# Altium project BMS_AFE.PrjPcb (part 1 of 2)
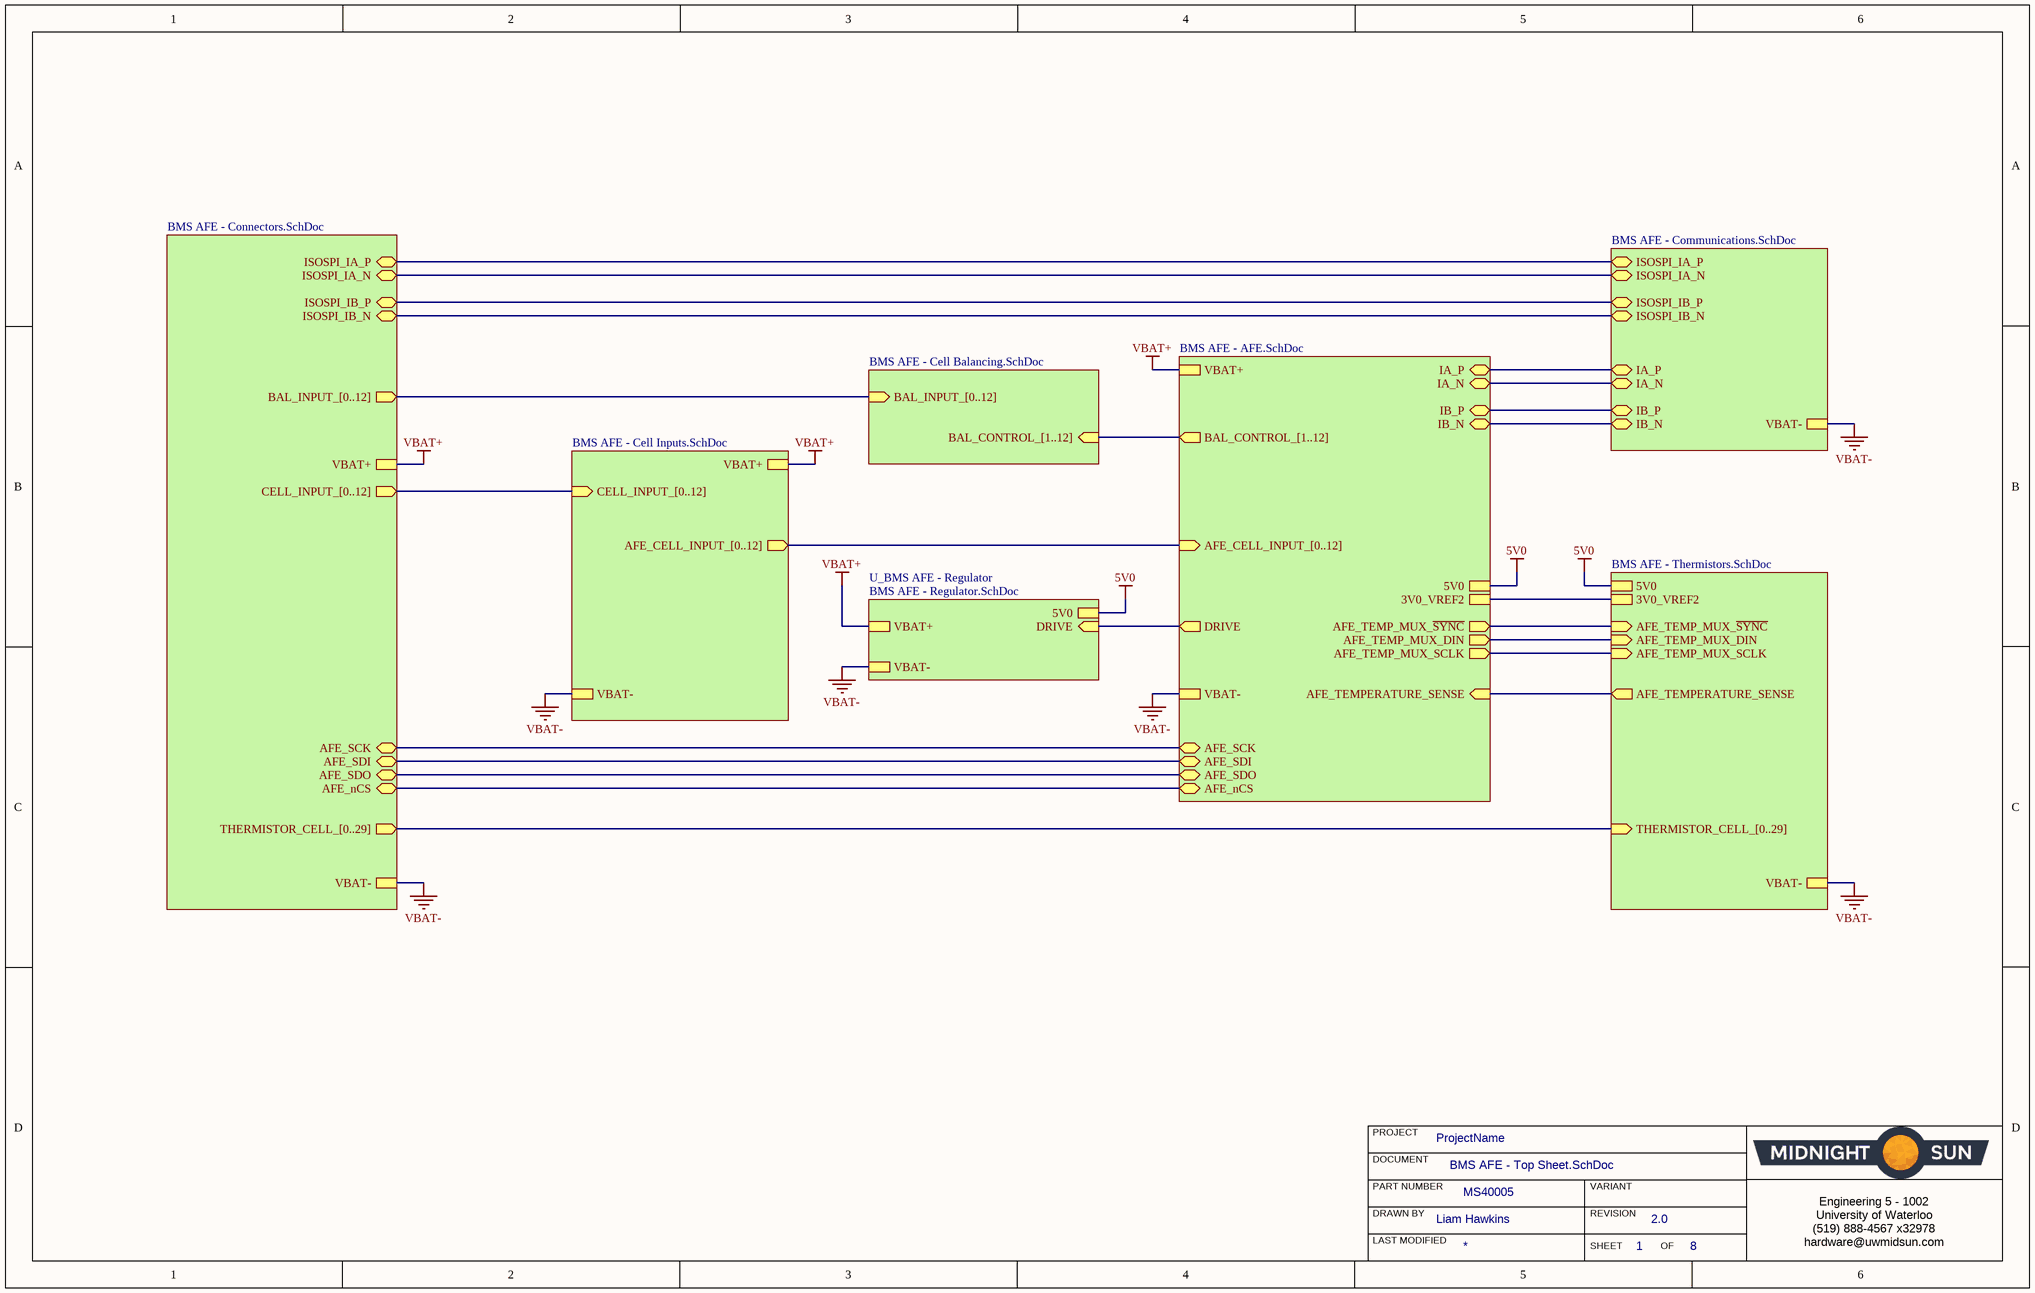
[diagram p0: BMS AFE - Top Sheet.SchDoc]
MSPartNumber: MS40005; ProjectAuthor: Liam Hawkins; ProjectRevision: 2.0
8 sheets, 138 parts. Net scope: strictly hierarchical (ports join the sheet entries above them; power ports are local).
Board file: AFE.PcbDoc
Sheets:
  BMS AFE - Top Sheet.SchDoc
    BMS AFE - AFE = BMS AFE - AFE.SchDoc
    BMS AFE - Cell Balancing = BMS AFE - Cell Balancing.SchDoc
    BMS AFE - Cell Inputs = BMS AFE - Cell Inputs.SchDoc
    BMS AFE - Communications = BMS AFE - Communications.SchDoc
    BMS AFE - Thermistors = BMS AFE - Thermistors.SchDoc
    BMS AFE - Connectors = BMS AFE - Connectors.SchDoc
    U_BMS AFE - Regulator = BMS AFE - Regulator.SchDoc

## Sheet BMS AFE - Top Sheet.SchDoc: Title
size B; Organization: Midnight Sun Solar Rayce Car Team; Address1: University of Waterloo; Address2: 200 University Ave W; Address3: Waterloo, ON, Canada; Address4: N2L 3E9; DocumentNumber: 1; SheetNumber: 1; SheetTotal: 8; Website: www.uwmidsun.com; ProjectName: ProjectName

### Sub-sheets
BMS AFE - AFE = BMS AFE - AFE.SchDoc: BAL_CONTROL_[1..12] (out), AFE_TEMP_MUX_~{SYNC} (out), AFE_nCS (bidir), AFE_SCK (bidir), AFE_TEMP_MUX_SCLK (out), 5V0, VBAT-, 3V0_VREF2, AFE_CELL_INPUT_[0..12] (in), AFE_TEMPERATURE_SENSE (in), AFE_TEMP_MUX_DIN (out), VBAT+, AFE_SDI (bidir), AFE_SDO (bidir), IA_N (bidir), IA_P (bidir), IB_N (bidir), IB_P (bidir), DRIVE (out)
BMS AFE - Cell Balancing = BMS AFE - Cell Balancing.SchDoc: BAL_CONTROL_[1..12] (in), BAL_INPUT_[0..12] (in)
BMS AFE - Cell Inputs = BMS AFE - Cell Inputs.SchDoc: VBAT+, CELL_INPUT_[0..12] (in), AFE_CELL_INPUT_[0..12] (out), VBAT-
BMS AFE - Communications = BMS AFE - Communications.SchDoc: IB_P (bidir), IB_N (bidir), ISOSPI_IA_P (bidir), ISOSPI_IA_N (bidir), IA_P (bidir), ISOSPI_IB_P (bidir), IA_N (bidir), ISOSPI_IB_N (bidir), VBAT-
BMS AFE - Connectors = BMS AFE - Connectors.SchDoc: ISOSPI_IB_N (bidir), ISOSPI_IB_P (bidir), ISOSPI_IA_N (bidir), ISOSPI_IA_P (bidir), VBAT+, AFE_nCS (bidir), AFE_SCK (bidir), CELL_INPUT_[0..12] (out), THERMISTOR_CELL_[0..29] (out), AFE_SDI (bidir), AFE_SDO (bidir), VBAT-, BAL_INPUT_[0..12] (out)
BMS AFE - Thermistors = BMS AFE - Thermistors.SchDoc: AFE_TEMPERATURE_SENSE (out), 5V0, 3V0_VREF2, AFE_TEMP_MUX_SCLK (in), AFE_TEMP_MUX_DIN (in), AFE_TEMP_MUX_~{SYNC} (in), THERMISTOR_CELL_[0..29] (in), VBAT-
U_BMS AFE - Regulator = BMS AFE - Regulator.SchDoc: DRIVE (in), VBAT+, 5V0, VBAT-

### Nets
3V0_VREF2: sheet BMS AFE - AFE/3V0_VREF2, sheet BMS AFE - Thermistors/3V0_VREF2
5V0: sheet BMS AFE - AFE/5V0, sheet BMS AFE - Thermistors/5V0, sheet U_BMS AFE - Regulator/5V0
VBAT+: sheet BMS AFE - AFE/VBAT+, sheet BMS AFE - Cell Inputs/VBAT+, sheet BMS AFE - Connectors/VBAT+, sheet U_BMS AFE - Regulator/VBAT+
VBAT-: sheet BMS AFE - AFE/VBAT-, sheet BMS AFE - Cell Inputs/VBAT-, sheet BMS AFE - Communications/VBAT-, sheet BMS AFE - Thermistors/VBAT-, sheet BMS AFE - Connectors/VBAT-, sheet U_BMS AFE - Regulator/VBAT-
AFE_TEMP_MUX_DIN: sheet BMS AFE - AFE/AFE_TEMP_MUX_DIN, sheet BMS AFE - Thermistors/AFE_TEMP_MUX_DIN
AFE_TEMP_MUX_~{SYNC}: sheet BMS AFE - AFE/AFE_TEMP_MUX_~{SYNC}, sheet BMS AFE - Thermistors/AFE_TEMP_MUX_~{SYNC}
AFE_TEMP_MUX_SCLK: sheet BMS AFE - AFE/AFE_TEMP_MUX_SCLK, sheet BMS AFE - Thermistors/AFE_TEMP_MUX_SCLK
IA_N: sheet BMS AFE - AFE/IA_N, sheet BMS AFE - Communications/IA_N
IA_P: sheet BMS AFE - AFE/IA_P, sheet BMS AFE - Communications/IA_P
IB_N: sheet BMS AFE - AFE/IB_N, sheet BMS AFE - Communications/IB_N
IB_P: sheet BMS AFE - AFE/IB_P, sheet BMS AFE - Communications/IB_P
ISOSPI_IA_N: sheet BMS AFE - Communications/ISOSPI_IA_N, sheet BMS AFE - Connectors/ISOSPI_IA_N
ISOSPI_IA_P: sheet BMS AFE - Communications/ISOSPI_IA_P, sheet BMS AFE - Connectors/ISOSPI_IA_P
ISOSPI_IB_N: sheet BMS AFE - Communications/ISOSPI_IB_N, sheet BMS AFE - Connectors/ISOSPI_IB_N
ISOSPI_IB_P: sheet BMS AFE - Communications/ISOSPI_IB_P, sheet BMS AFE - Connectors/ISOSPI_IB_P
NetC34_1: sheet BMS AFE - AFE/AFE_TEMPERATURE_SENSE, sheet BMS AFE - Thermistors/AFE_TEMPERATURE_SENSE
NetP7_1: sheet BMS AFE - AFE/AFE_nCS, sheet BMS AFE - Connectors/AFE_nCS
NetP7_2: sheet BMS AFE - AFE/AFE_SCK, sheet BMS AFE - Connectors/AFE_SCK
NetP7_3: sheet BMS AFE - AFE/AFE_SDI, sheet BMS AFE - Connectors/AFE_SDI
NetP7_4: sheet BMS AFE - AFE/AFE_SDO, sheet BMS AFE - Connectors/AFE_SDO
NetR52_1: sheet BMS AFE - AFE/DRIVE, sheet U_BMS AFE - Regulator/DRIVE

### Buses and harness runs
bus sheet BMS AFE - AFE/AFE_CELL_INPUT_[0..12] = sheet BMS AFE - Cell Inputs/AFE_CELL_INPUT_[0..12]
bus sheet BMS AFE - AFE/BAL_CONTROL_[1..12] = sheet BMS AFE - Cell Balancing/BAL_CONTROL_[1..12]
bus sheet BMS AFE - Cell Balancing/BAL_INPUT_[0..12] = sheet BMS AFE - Connectors/BAL_INPUT_[0..12]
bus sheet BMS AFE - Cell Inputs/CELL_INPUT_[0..12] = sheet BMS AFE - Connectors/CELL_INPUT_[0..12]
bus sheet BMS AFE - Connectors/THERMISTOR_CELL_[0..29] = sheet BMS AFE - Thermistors/THERMISTOR_CELL_[0..29]

### Notes on the sheet
- PROJECT
- DOCUMENT
- DRAWN BY
- LAST MODIFIED
- PART NUMBER
- REVISION
- SHEET
- VARIANT
- OF
- Engineering 5 - 1002
  University of Waterloo
  (519) 888-4567 x32978
  hardware@uwmidsun.com

## Sheet BMS AFE - AFE.SchDoc: Title
size B; Organization: Midnight Sun Solar Rayce Car Team; Address1: University of Waterloo; Address2: 200 University Ave W; Address3: Waterloo, ON, Canada; Address4: N2L 3E9; DocumentNumber: 5; SheetNumber: 5; SheetTotal: 8; Website: www.uwmidsun.com; ProjectName: ProjectName
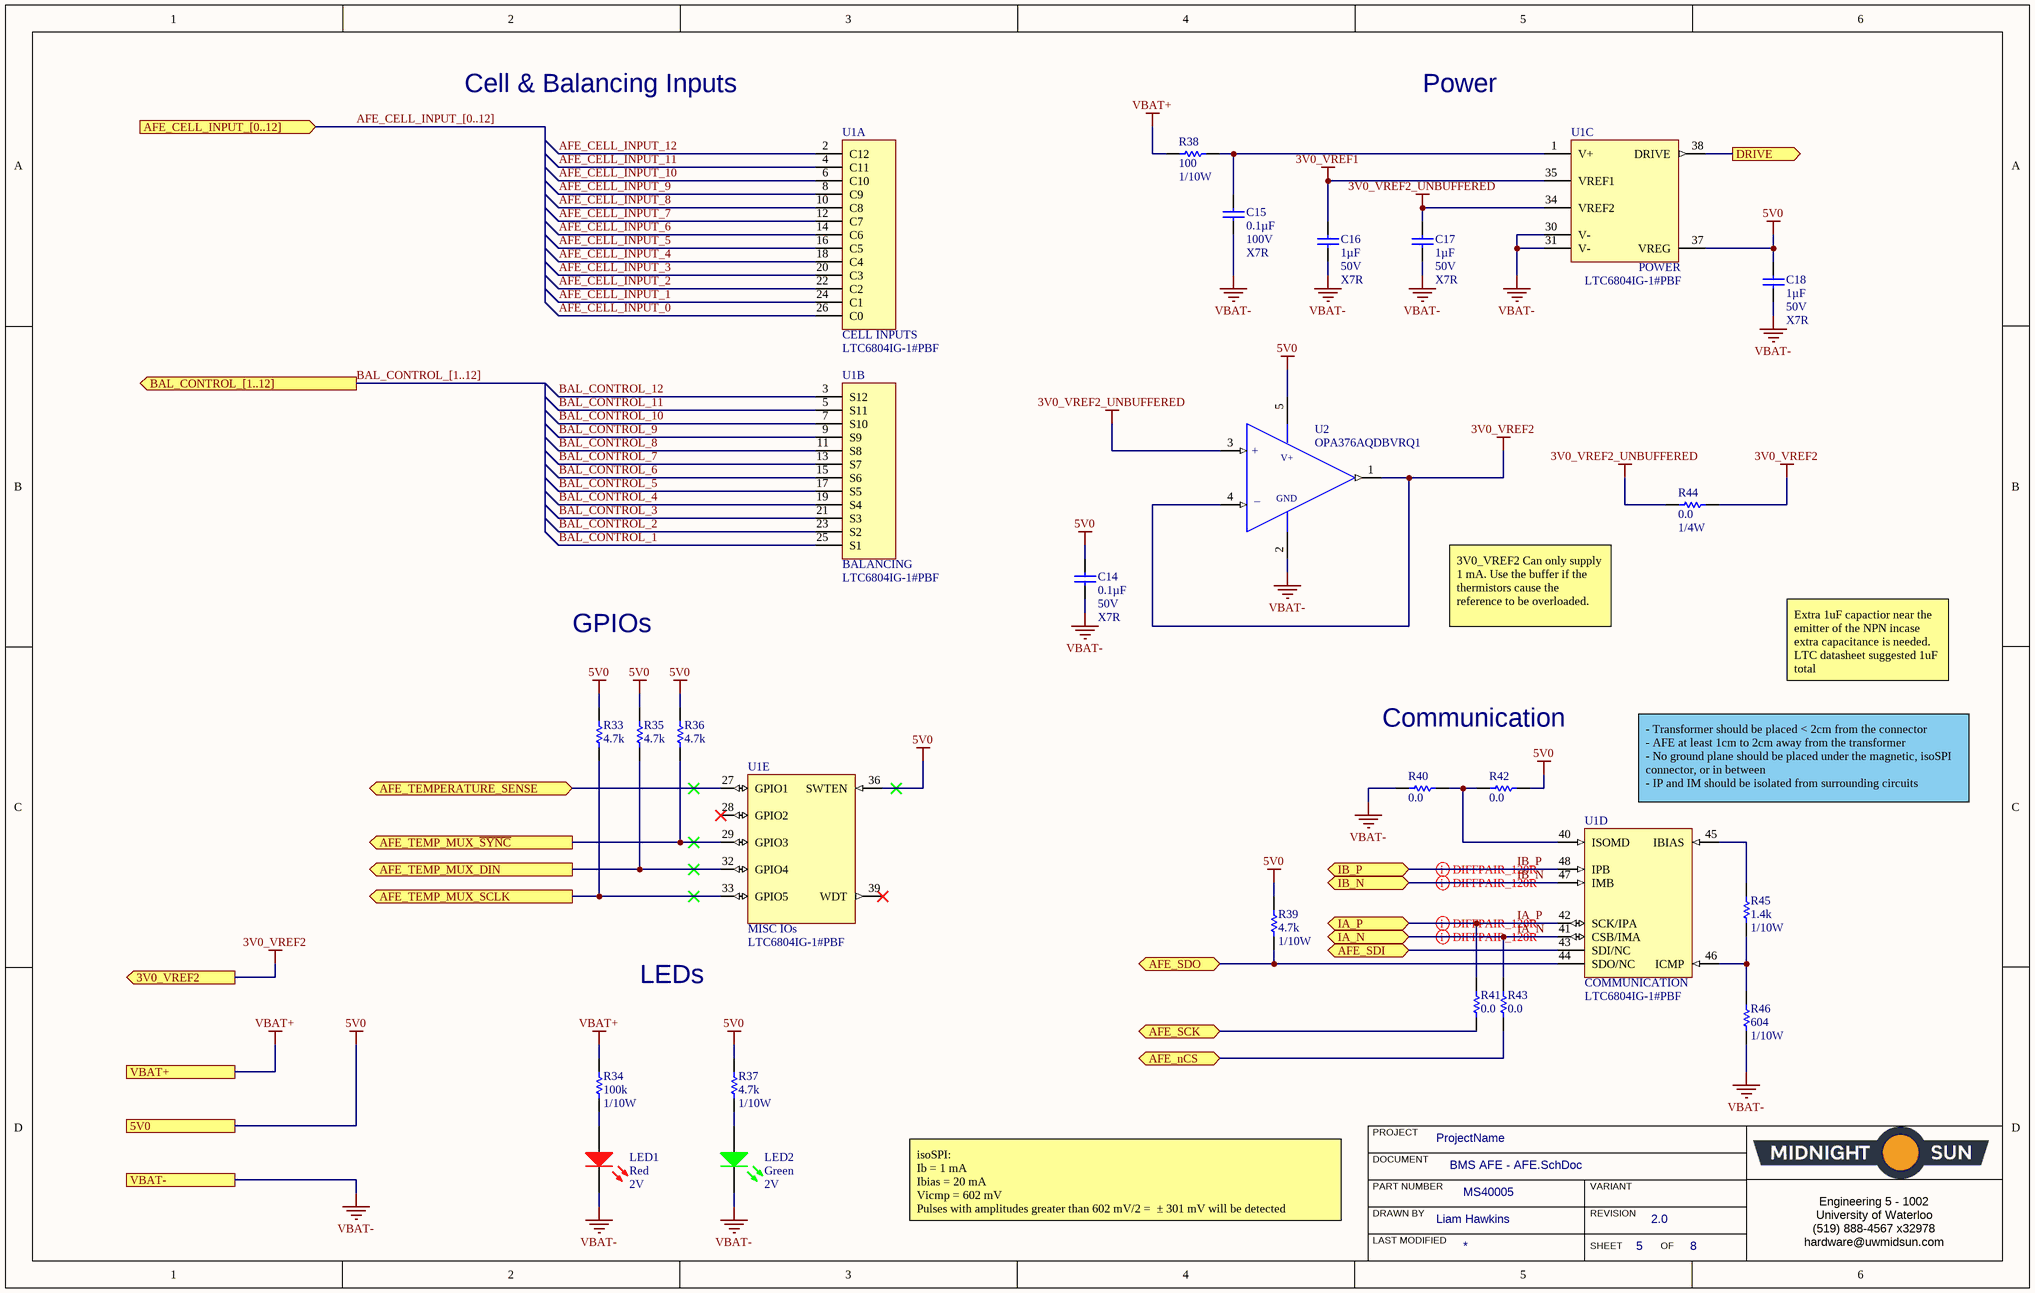
[diagram p1: BMS AFE - AFE.SchDoc]

### Parts
(Parts that share a designator on the sheet are numbered #1, #2 ... from top to bottom, then left to right.)
C14  Capacitance: 0.1µF  Voltage: 50V  Temperature Coefficient: X7R  [CAP, 0603]  (hidden comment: CAP CER 0.1UF 50V 10% X7R 0603)
C15  Capacitance: 0.1µF  Voltage: 100V  Temperature Coefficient: X7R  [CAP, 0805]  (hidden comment: CAP CER 0.1UF 100V 10% X7R 0805)
C16  Capacitance: 1µF  Voltage: 50V  Temperature Coefficient: X7R  [CAP, 0603]  (hidden comment: CAP CER 1UF 50V 10% X7R 0603)
C17  Capacitance: 1µF  Voltage: 50V  Temperature Coefficient: X7R  [CAP, 0603]  (hidden comment: CAP CER 1UF 50V 10% X7R 0603)
C18  Capacitance: 1µF  Voltage: 50V  Temperature Coefficient: X7R  [CAP, 0603]  (hidden comment: CAP CER 1UF 50V 10% X7R 0603)
LED1  Color: Red  Voltage - Forward (Vf) (Typ): 2V  [LED_0603]  (hidden comment: LED RED CLEAR 2V 0603)
LED2  Color: Green  Voltage - Forward (Vf) (Typ): 2V  [LED_0603]  (hidden comment: LED GREEN CLEAR 2V 0603)
R33#1  Resistance (Ohms): 4.7k  [RES, 0603]  (hidden comment: RES 4.7K OHM 1% 1/10W 0603)
R34#1  Resistance: 100k  Power: 1/10W  [RES, 0603]  (hidden comment: RES 100K OHM 5% 1/8W 0603)
R35#1  Resistance (Ohms): 4.7k  [RES, 0603]  (hidden comment: RES 4.7K OHM 1% 1/10W 0603)
R36#1  Resistance (Ohms): 4.7k  [RES, 0603]  (hidden comment: RES 4.7K OHM 1% 1/10W 0603)
R37#1  Resistance (Ohms): 4.7k  Power (Watts): 1/10W  [RES, 0603]  (hidden comment: RES 4.7K OHM 1% 1/10W 0603)
R38#1  Resistance: 100  Power: 1/10W  [RES, 0603]  (hidden comment: RES 100 OHM 1% 1/10W 0603)
R39#1  Resistance (Ohms): 4.7k  Power (Watts): 1/10W  [RES, 0603]  (hidden comment: RES 4.7K OHM 1% 1/10W 0603)
R40#1  Resistance: 0.0  [RES, 0603]  (hidden comment: RES 0.0 OHM 1/4W 0603)
R41  Resistance: 0.0  [RES, 0603]  (hidden comment: RES 0.0 OHM 1/4W 0603)
R42  Resistance: 0.0  [RES, 0603]  (hidden comment: RES 0.0 OHM 1/4W 0603)
R43  Resistance: 0.0  [RES, 0603]  (hidden comment: RES 0.0 OHM 1/4W 0603)
R44  Resistance: 0.0  Power (Watts): 1/4W  [RES, 0603]  (hidden comment: RES 0.0 OHM 1/4W 0603)
R45  Resistance: 1.4k  Power: 1/10W  [RES, 0603]  (hidden comment: RES 1.4k OHM 1% 1/10W 0603)
R46  Resistance: 604  Power: 1/10W  [RES, 0603]  (hidden comment: RES 604 OHM 1% 1/10W 0603)
U1  Manufacturer Part Number 1: LTC6804IG-1#PBF  [SSOP50P780X200-48N]  (hidden comment: IC MONITOR BATT STACK 48SSOP)  (parts A,B,C,D,E of 5)
U2  Manufacturer Part Number: OPA376AQDBVRQ1  [IC OP AMP GP RR 10MHZ SOT-23-5]  (hidden comment: IC OP AMP GEN PURPOSE RR 5.5MHZ SOT-23-5)

### Ports
3V0_VREF2 (out), 5V0, AFE_CELL_INPUT_[0..12] (in), AFE_nCS (bidir), AFE_SCK (bidir), AFE_SDI (bidir), AFE_SDO (bidir), AFE_TEMP_MUX_DIN (out), AFE_TEMP_MUX_SCLK (out), AFE_TEMP_MUX_~{SYNC} (out), AFE_TEMPERATURE_SENSE (bidir), BAL_CONTROL_[1..12] (out), DRIVE (out), IA_N (bidir), IA_P (bidir), IB_N (bidir), IB_P (bidir), VBAT+, VBAT-

### Nets
3V0_VREF1: C16.1 U1.35(VREF1)
3V0_VREF2: R44.2 U2.1(OUTPUT) U2.4(-IN) ; port 3V0_VREF2
3V0_VREF2_UNBUFFERED: C17.1 R44.1 U1.34(VREF2) U2.3(+IN)
5V0: C14.1 C18.1 R33#1.2 R35#1.2 R36#1.2 R37#1.1 R39#1.1 R42.2 U1.36(SWTEN) U1.37(VREG) U2.5(VDD) ; port 5V0
VBAT+: R34#1.1 R38#1.1 ; port VBAT+
VBAT-: C14.2 C15.2 C16.2 C17.2 C18.2 LED1.2(K) LED2.2(K) R40#1.1 R46.2 U1.30(V-) U1.31(V-) U2.2(VSS) ; port VBAT-
AFE_CELL_INPUT_0: U1.26(C0)
AFE_CELL_INPUT_1: U1.24(C1)
AFE_CELL_INPUT_2: U1.22(C2)
AFE_CELL_INPUT_3: U1.20(C3)
AFE_CELL_INPUT_4: U1.18(C4)
AFE_CELL_INPUT_5: U1.16(C5)
AFE_CELL_INPUT_6: U1.14(C6)
AFE_CELL_INPUT_7: U1.12(C7)
AFE_CELL_INPUT_8: U1.10(C8)
AFE_CELL_INPUT_9: U1.8(C9)
AFE_CELL_INPUT_10: U1.6(C10)
AFE_CELL_INPUT_11: U1.4(C11)
AFE_CELL_INPUT_12: U1.2(C12)
AFE_TEMP_MUX_DIN: R35#1.1 U1.32(GPIO4) ; port AFE_TEMP_MUX_DIN
AFE_TEMP_MUX_~{SYNC}: R36#1.1 U1.29(GPIO3) ; port AFE_TEMP_MUX_~{SYNC}
AFE_TEMP_MUX_SCLK: R33#1.1 U1.33(GPIO5) ; port AFE_TEMP_MUX_SCLK
BAL_CONTROL_1: U1.25(S1)
BAL_CONTROL_2: U1.23(S2)
BAL_CONTROL_3: U1.21(S3)
BAL_CONTROL_4: U1.19(S4)
BAL_CONTROL_5: U1.17(S5)
BAL_CONTROL_6: U1.15(S6)
BAL_CONTROL_7: U1.13(S7)
BAL_CONTROL_8: U1.11(S8)
BAL_CONTROL_9: U1.9(S9)
BAL_CONTROL_10: U1.7(S10)
BAL_CONTROL_11: U1.5(S11)
BAL_CONTROL_12: U1.3(S12)
IA_N: R43.1 U1.41(CSB/IMA) ; port IA_N
IA_P: R41.1 U1.42(SCK/IPA) ; port IA_P
IB_N: U1.47(IMB) ; port IB_N
IB_P: U1.48(IPB) ; port IB_P
NetC15_1: C15.1 R38#1.2 U1.1(V+)
NetC34_1: U1.27(GPIO1) ; port AFE_TEMPERATURE_SENSE
NetLED1_1: LED1.1(A) R34#1.2
NetLED2_1: LED2.1(A) R37#1.2
NetP7_1: R43.2 ; port AFE_nCS
NetP7_2: R41.2 ; port AFE_SCK
NetP7_3: U1.43(SDI/NC) ; port AFE_SDI
NetP7_4: R39#1.2 U1.44(SDO/NC) ; port AFE_SDO
NetR40#1_2: R40#1.2 R42.1 U1.40(ISOMD)
NetR45_1: R45.1 U1.45(IBIAS)
NetR45_2: R45.2 R46.1 U1.46(ICMP)
NetR52_1: U1.38(DRIVE) ; port DRIVE

Not connected (* = marked no-connect by the designer): U1 28(GPIO2)* 39(WDT)*

### Buses and harness runs
bus AFE_CELL_INPUT_[0..12] = port AFE_CELL_INPUT_[0..12]
bus BAL_CONTROL_[1..12] = port BAL_CONTROL_[1..12]

### Layout directives
differential pair: IA_N, IA_P, IB_N, IB_P

### Notes on the sheet
- Cell & Balancing Inputs
- Power
- GPIOs
- 3V0_VREF2 Can only supply  1 mA. Use the buffer if the thermistors cause the reference to be overloaded.
- Extra 1uF capactior near the emitter of the NPN incase extra capacitance is needed. LTC datasheet suggested 1uF total
- Communication
- (near U1) - Transformer should be placed < 2cm from the connector
  - AFE at least 1cm to 2cm away from the transformer
  - No ground plane should be placed under the magnetic, isoSPI connector, or in between
  - IP and IM should be isolated from surrounding circuits
- LEDs
- isoSPI:
  Ib = 1 mA
  Ibias = 20 mA
  Vicmp = 602 mV
  Pulses with amplitudes greater than 602 mV/2 =  ± 301 mV will be detected
- PROJECT
- DOCUMENT
- DRAWN BY
- LAST MODIFIED
- PART NUMBER
- REVISION
- SHEET
- VARIANT
- OF
- Engineering 5 - 1002
  University of Waterloo
  (519) 888-4567 x32978
  hardware@uwmidsun.com
- (in symbol IC MONITOR BATT STACK 48SSOP, part A) CELL INPUTS
- (in symbol IC MONITOR BATT STACK 48SSOP, part B) BALANCING
- (in symbol IC MONITOR BATT STACK 48SSOP, part C) POWER
- (in symbol IC MONITOR BATT STACK 48SSOP, part D) COMMUNICATION
- (in symbol IC MONITOR BATT STACK 48SSOP, part E) MISC IOs
- (in symbol IC OP AMP GEN PURPOSE RR 5.5MHZ SOT-23-5) +; V+; GND; _

### Library data of the parts
C14 = CAP CER 0.1UF 50V 10% X7R 0603: 0.10µF ±10% 50V Ceramic Capacitor X7R 0603 (1608 Metric); Manufacturer 1: AVX Corporation; Manufacturer Part Number 1: 06035C104KAT2A; Supplier 1: Digi-Key; Supplier Part Number 1: 478-5052-1-ND; Packaging: Cut Tape (CT); Part Status: Active; Operating Temperature: -55°C ~ 125°C; Ratings: -; Mounting Type: Surface Mount, MLCC; Package / Case: 0603 (1608 Metric); Size / Dimension: 0.063" L x 0.032" W (1.60mm x 0.81mm); Height - Seated (Max): -; Thickness (Max): 0.035" (0.90mm); Lead Spacing: -; Lead Style: -; ComponentLink1URL: http://datasheets.avx.com/X7RDielectric.pdf; ComponentLink1Description: http://datasheets.avx.com/X7RDielectric.pdf; Tolerance: ±10%
C15 = CAP CER 0.1UF 100V 10% X7R 0805: 0.1µF ±10% 100V Ceramic Capacitor X7R 0805 (2012 Metric); Manufacturer 1: Murata Electronics North America; Manufacturer Part Number 1: GCM21BR72A104KA37L; Supplier 1: Digi-Key; Supplier Part Number 1: 490-4789-1-ND; Packaging: Cut Tape (CT); Part Status: Active; Operating Temperature: -55°C ~ 125°C; Ratings: AEC-Q200; Mounting Type: Surface Mount, MLCC; Package / Case: 0805 (2012 Metric); Size / Dimension: 0.079" L x 0.049" W (2.00mm x 1.25mm); Height - Seated (Max): -; Thickness (Max): 0.055" (1.40mm); Lead Spacing: -; Lead Style: -; ComponentLink1URL: http://www.murata.com/~/media/webrenewal/support/library/catalog/products/capacitor/mlcc/c03e.ashx; ComponentLink1Description: http://www.murata.com/~/media/webrenewal/support/library/catalog/products/capacitor/mlcc/c03e.ashx; Tolerance: ±10%
C16-C18 = CAP CER 1UF 50V 10% X7R 0603: 1µF ±10% 50V Ceramic Capacitor X7R 0603 (1608 Metric); Manufacturer 1: Taiyo Yuden; Manufacturer Part Number 1: UMK107AB7105KA-T; Supplier 1: Digi-Key; Supplier Part Number 1: 587-3247-1-ND; Packaging: Cut Tape (CT); Part Status: Active; Operating Temperature: -55°C ~ 125°C; Ratings: -; Mounting Type: Surface Mount, MLCC; Package / Case: 0603 (1608 Metric); Size / Dimension: 0.063" L x 0.031" W (1.60mm x 0.80mm); Height - Seated (Max): -; Thickness (Max): 0.037" (0.95mm); Lead Spacing: -; Lead Style: -; ComponentLink1URL: http://www.yuden.co.jp/productdata/catalog/en/mlcc_all_e.pdf; ComponentLink1Description: http://www.yuden.co.jp/productdata/catalog/en/mlcc_all_e.pdf; Tolerance: ±10%
LED1 = LED RED CLEAR 2V 0603: Red 631nm LED Indication - Discrete 2V 0603 (1608 Metric); Manufacturer: Wurth Electronics Inc.; Manufacturer Part Number: 150060RS75000; Lens Color: Colorless; Millicandela Rating: 250mcd; Lens Style/Size: Rectangle with Flat Top, 1.10mm x 0.70mm; Current - Test: 20mA; Viewing Angle: 140°; Wavelength - Dominant: 625nm; Wavelength - Peak: 630nm; Supplier 1: Digi-Key; RoHS: RoHS Compliant; Category: Optoelectronics; Stock 1: 35521; Pricing 1: 1=0.21, 100=0.1617, 500=0.13964 (CAD); Packaging: Cut Tape (CT); Part Status: Active; Lens Transparency: Clear; Mounting Type: Surface Mount; Features: -; Package / Case: 0603 (1608 Metric); Supplier Device Package: 0603; Size / Dimension: 1.60mm L x 0.80mm W; Height (Max): 0.80mm; ComponentLink1URL: http://katalog.we-online.de/led/datasheet/150060RS75000.pdf; ComponentLink1Description: http://katalog.we-online.de/led/datasheet/150060RS75000.pdf; Supplier Part Number 1: 732-4978-1-ND
LED2 = LED GREEN CLEAR 2V 0603: Green 572nm LED Indication - Discrete 2V 0603 (1608 Metric); Manufacturer: Wurth Electronics Inc.; Manufacturer Part Number: 150060VS75000; Lens Color: Colorless; Millicandela Rating: 40mcd; Lens Style/Size: Rectangle with Flat Top, 1.10mm x 0.70mm; Current - Test: 20mA; Viewing Angle: 140°; Wavelength - Dominant: 570nm; Supplier 1: Digi-Key; RoHS: RoHS Compliant; Category: Optoelectronics; Stock 1: 9408; Pricing 1: 1=0.21, 100=0.1617, 500=0.13964 (CAD); Packaging: Cut Tape (CT); Part Status: Active; Lens Transparency: Clear; Mounting Type: Surface Mount; Wavelength - Peak: 572nm; Features: -; Package / Case: 0603 (1608 Metric); Supplier Device Package: 0603; Size / Dimension: 1.60mm L x 0.80mm W; Height (Max): 0.80mm; ComponentLink1URL: http://katalog.we-online.de/led/datasheet/150060VS75000.pdf; ComponentLink1Description: http://katalog.we-online.de/led/datasheet/150060VS75000.pdf; Supplier Part Number 1: 732-4980-1-ND
R33#1 R35#1 R36#1 R39#1 = RES 4.7K OHM 1% 1/10W 0603: 4.7k Ohm ±1% 0.1W, 1/10W Chip Resistor 0603 (1608 Metric) Moisture Resistant Thick Film; Manufacturer 1: Yageo; Manufacturer Part Number 1: RC0603FR-074K7L; Description 1: RES SMD 4.7K OHM 1% 1/10W 0603; Temperature Coefficient: ±100ppm/°C; Supplier 1: Digi-Key; Supplier Part Number 1: 311-4.70KHRCT-ND; RoHS: RoHS Compliant; Category: Resistors; Stock 1: 3487566; Pricing 1: 1=0.16, 10=0.022, 100=0.0089, 1000=0.00402, 2500=0.00349 (CAD); Packaging: Cut Tape (CT); Part Status: Active; Composition: Thick Film; Features: Moisture Resistant; Operating Temperature: -55°C ~ 155°C; Package / Case: 0603 (1608 Metric); Supplier Device Package: 0603; Size / Dimension: 0.063" L x 0.031" W (1.60mm x 0.80mm); Height - Seated (Max): 0.022" (0.55mm); Failure Rate: -; ComponentLink1URL: http://www.yageo.com/documents/recent/PYu-RC_Group_51_RoHS_L_7.pdf; ComponentLink1Description: http://www.yageo.com/documents/recent/PYu-RC_Group_51_RoHS_L_7.pdf; Tolerance: ±1%
  R33#1 R35#1 R36#1: Power (Watts): 1/10W
R34#1 = RES 100K OHM 5% 1/8W 0603: RES SMD 100K OHM 5% 1/10W 0603; Manufacturer 1: Yageo; Manufacturer Part Number 1: RC0603JR-07100KL; Temperature Coefficient: ±100ppm/°C; Supplier 1: Digi-Key; Supplier Part Number 1: 311-100KGRCT-ND; Packaging: Cut Tape (CT); Part Status: Active; Composition: Thick Film; Operating Temperature: -55°C ~ 155°C; Package / Case: 0603 (1608 Metric); Supplier Device Package: 0603; Size / Dimension: 0.063" L x 0.031" W (1.60mm x 0.80mm); Height - Seated (Max): 0.022" (0.55mm); Failure Rate: -; ComponentLink1URL: http://www.yageo.com/documents/recent/PYu-RC_Group_51_RoHS_L_7.pdf; ComponentLink1Description: http://www.yageo.com/documents/recent/PYu-RC_Group_51_RoHS_L_7.pdf; Tolerance: ±5%
R37#1 = RES 4.7K OHM 1% 1/10W 0603: 4.7k Ohm ±1% 0.1W, 1/10W Chip Resistor 0603 (1608 Metric) Moisture Resistant Thick Film; Manufacturer 1: Yageo; Manufacturer Part Number 1: RC0603FR-074K7L; Temperature Coefficient: ±100ppm/°C; Description 1: RES SMD 4.7K OHM 1% 1/10W 0603; Supplier 1: Digi-Key; Supplier Part Number 1: 311-4.70KHRCT-ND; Packaging: Cut Tape (CT); Part Status: Active; Composition: Thick Film; Operating Temperature: -55°C ~ 155°C; Package / Case: 0603 (1608 Metric); Supplier Device Package: 0603; Size / Dimension: 0.063" L x 0.031" W (1.60mm x 0.80mm); Height - Seated (Max): 0.022" (0.55mm); Failure Rate: -; ComponentLink1URL: http://www.yageo.com/documents/recent/PYu-RC_Group_51_RoHS_L_7.pdf; ComponentLink1Description: http://www.yageo.com/documents/recent/PYu-RC_Group_51_RoHS_L_7.pdf; Tolerance: ±1%; RoHS: RoHS Compliant; Category: Resistors; Stock 1: 3487566; Pricing 1: 1=0.16, 10=0.022, 100=0.0089, 1000=0.00402, 2500=0.00349 (CAD); Features: Moisture Resistant
R38#1 = RES 100 OHM 1% 1/10W 0603: 100 Ohm ±1% 0.1W, 1/10W Chip Resistor 0603 (1608 Metric) Moisture Resistant Thick Film; Manufacturer 1: Yageo; Manufacturer Part Number 1: RC0603FR-07100RL; Temperature Coefficient: ±100ppm/°C; Supplier 1: Digi-Key; Supplier Part Number 1: 311-100HRCT-ND; Packaging: Cut Tape (CT); Part Status: Active; Composition: Thick Film; Operating Temperature: -55°C ~ 155°C; Package / Case: 0603 (1608 Metric); Supplier Device Package: 0603; Size / Dimension: 0.063" L x 0.031" W (1.60mm x 0.80mm); Height - Seated (Max): 0.022" (0.55mm); Failure Rate: -; ComponentLink1URL: http://www.yageo.com/documents/recent/PYu-RC_Group_51_RoHS_L_7.pdf; ComponentLink1Description: http://www.yageo.com/documents/recent/PYu-RC_Group_51_RoHS_L_7.pdf; Tolerance: ±1%
R40#1 R41-R44 = RES 0.0 OHM 1/4W 0603: RES SMD 0.0 OHM JUMPER 1/4W 0603; Manufacturer 1: Vishay Dale; Manufacturer Part Number 1: CRCW06030000Z0EAHP; Supplier 1: Digi-Key; Supplier Part Number 1: 541-0.0SBCT-ND; Packaging: Cut Tape (CT); Part Status: Active; Composition: Thick Film; Operating Temperature: -55°C ~ 155°C; Package / Case: 0603 (1608 Metric); Supplier Device Package: 0603; Size / Dimension: 0.063" L x 0.033" W (1.60mm x 0.85mm); Height - Seated (Max): 0.022" (0.55mm); Failure Rate: -; ComponentLink1URL: http://www.vishay.com/docs/20043/crcwhpe3.pdf; ComponentLink1Description: http://www.vishay.com/docs/20043/crcwhpe3.pdf
  R40#1 R41-R43: Power (Watts): 1/4W
R45 = RES 1.4k OHM 1% 1/10W 0603: RES SMD 1.4K OHM 1% 1/10W 0603; Manufacturer 1: Yageo; Manufacturer Part Number 1: RC0603FR-071K4L; Temperature Coefficient: ±100ppm/°C; Supplier 1: Digi-Key; Supplier Part Number 1: 311-1.40KHRCT-ND; Packaging: Cut Tape (CT); Part Status: Active; Composition: Thick Film; Operating Temperature: -55°C ~ 155°C; Package / Case: 0603 (1608 Metric); Supplier Device Package: 0603; Size / Dimension: 0.063" L x 0.031" W (1.60mm x 0.80mm); Height - Seated (Max): 0.022" (0.55mm); Failure Rate: -; ComponentLink1URL: http://www.yageo.com/documents/recent/PYu-RC_Group_51_RoHS_L_7.pdf; ComponentLink1Description: http://www.yageo.com/documents/recent/PYu-RC_Group_51_RoHS_L_7.pdf; Tolerance: ±1%
R46 = RES 604 OHM 1% 1/10W 0603: RES SMD 604 OHM 1% 1/10W 0603; Manufacturer 1: Yageo; Manufacturer Part Number 1: RC0603FR-07604RL; Temperature Coefficient: ±100ppm/°C; Supplier 1: Digi-Key; Supplier Part Number 1: 311-604HRCT-ND; Packaging: Cut Tape (CT); Part Status: Active; Composition: Thick Film; Operating Temperature: -55°C ~ 155°C; Package / Case: 0603 (1608 Metric); Supplier Device Package: 0603; Size / Dimension: 0.063" L x 0.031" W (1.60mm x 0.80mm); Height - Seated (Max): 0.022" (0.55mm); Failure Rate: -; ComponentLink1URL: http://www.yageo.com/documents/recent/PYu-RC_Group_51_RoHS_L_7.pdf; ComponentLink1Description: http://www.yageo.com/documents/recent/PYu-RC_Group_51_RoHS_L_7.pdf; Tolerance: ±1%
U1 = IC MONITOR BATT STACK 48SSOP: Battery Battery Monitor IC Multi-Chemistry 48-SSOP; Manufacturer 1: Linear Technology; Number of Cells: 1 ~ 12; Fault Protection: Over/Under Voltage; Interface: I²C, SPI; Supplier 1: Digi-Key; Supplier Part Number 1: LTC6804IG-1#PBF-ND; Packaging: Tube; Part Status: Active; Function: Battery Monitor; Battery Chemistry: Multi-Chemistry; Operating Temperature: -40°C ~ 85°C (TA); Package / Case: 48-FSOP (0.209", 5.30mm Width); Supplier Device Package: 48-SSOP; ComponentLink1URL: http://www.linear.com/docs/43171; ComponentLink1Description: http://www.linear.com/docs/43171
U2 = IC OP AMP GEN PURPOSE RR 5.5MHZ SOT-23-5: General Purpose Amplifier 1 Circuit Rail-to-Rail SOT-23-5; Manufacturer: Texas Instruments; Max Supply Voltage: 5.5V; Min Supply Voltage: 2.2V; Output Current: 30mA; Nominal Supply Current: 950uA; Voltage Gain: 134dB; Common Mode Rejection Ratio: 76dB; Number of Channels: 1; Slew Rate: 2V/µs; Max I/O Voltage: 25uV; Input Bias Current: 10pA; Operating Supply Current: 760uA; Output Current per Channel: 50mA; Power Supply Rejection Ratio (PSRR): 106.02dB; Supplier 1: Digi-Key; Stock 1: 26635; Pricing 1: 1 = 2.14000, 10 = 1.92200, 100 = 1.54450, 500 = 1.26896, 1000 = 1.05142 (USD); RoHS: Yes; Case/Package: SOT-23-5; Number of Pins: 5; Min Operating Temperature: -40°C; Max Operating Temperature: 125°C; Unity Gain Bandwidth Product: 5.5MHz; Packaging: Tape and Reel; Package Quantity: 3000; Number of Circuits: 1; Gain Bandwidth Product: 5.5MHz; Input Offset Voltage (Vos): 25uV; Number of Elements: 1; Radiation Hardening: No; Lead Free: Lead Free; ComponentLink1URL: http://www.ti.com/lit/ds/sbos549/sbos549.pdf?src-supplier=Avnet; ComponentLink1Description: http://www.ti.com/lit/ds/sbos549/sbos549.pdf?src-supplier=Avnet; Supplier Part Number 1: 296-36701-1-ND

## Sheet BMS AFE - Cell Balancing.SchDoc: Title
size B; Organization: Midnight Sun Solar Rayce Car Team; Address1: University of Waterloo; Address2: 200 University Ave W; Address3: Waterloo, ON, Canada; Address4: N2L 3E9; DocumentNumber: 4; SheetNumber: 4; SheetTotal: 7; Website: www.uwmidsun.com; ProjectName: ProjectName
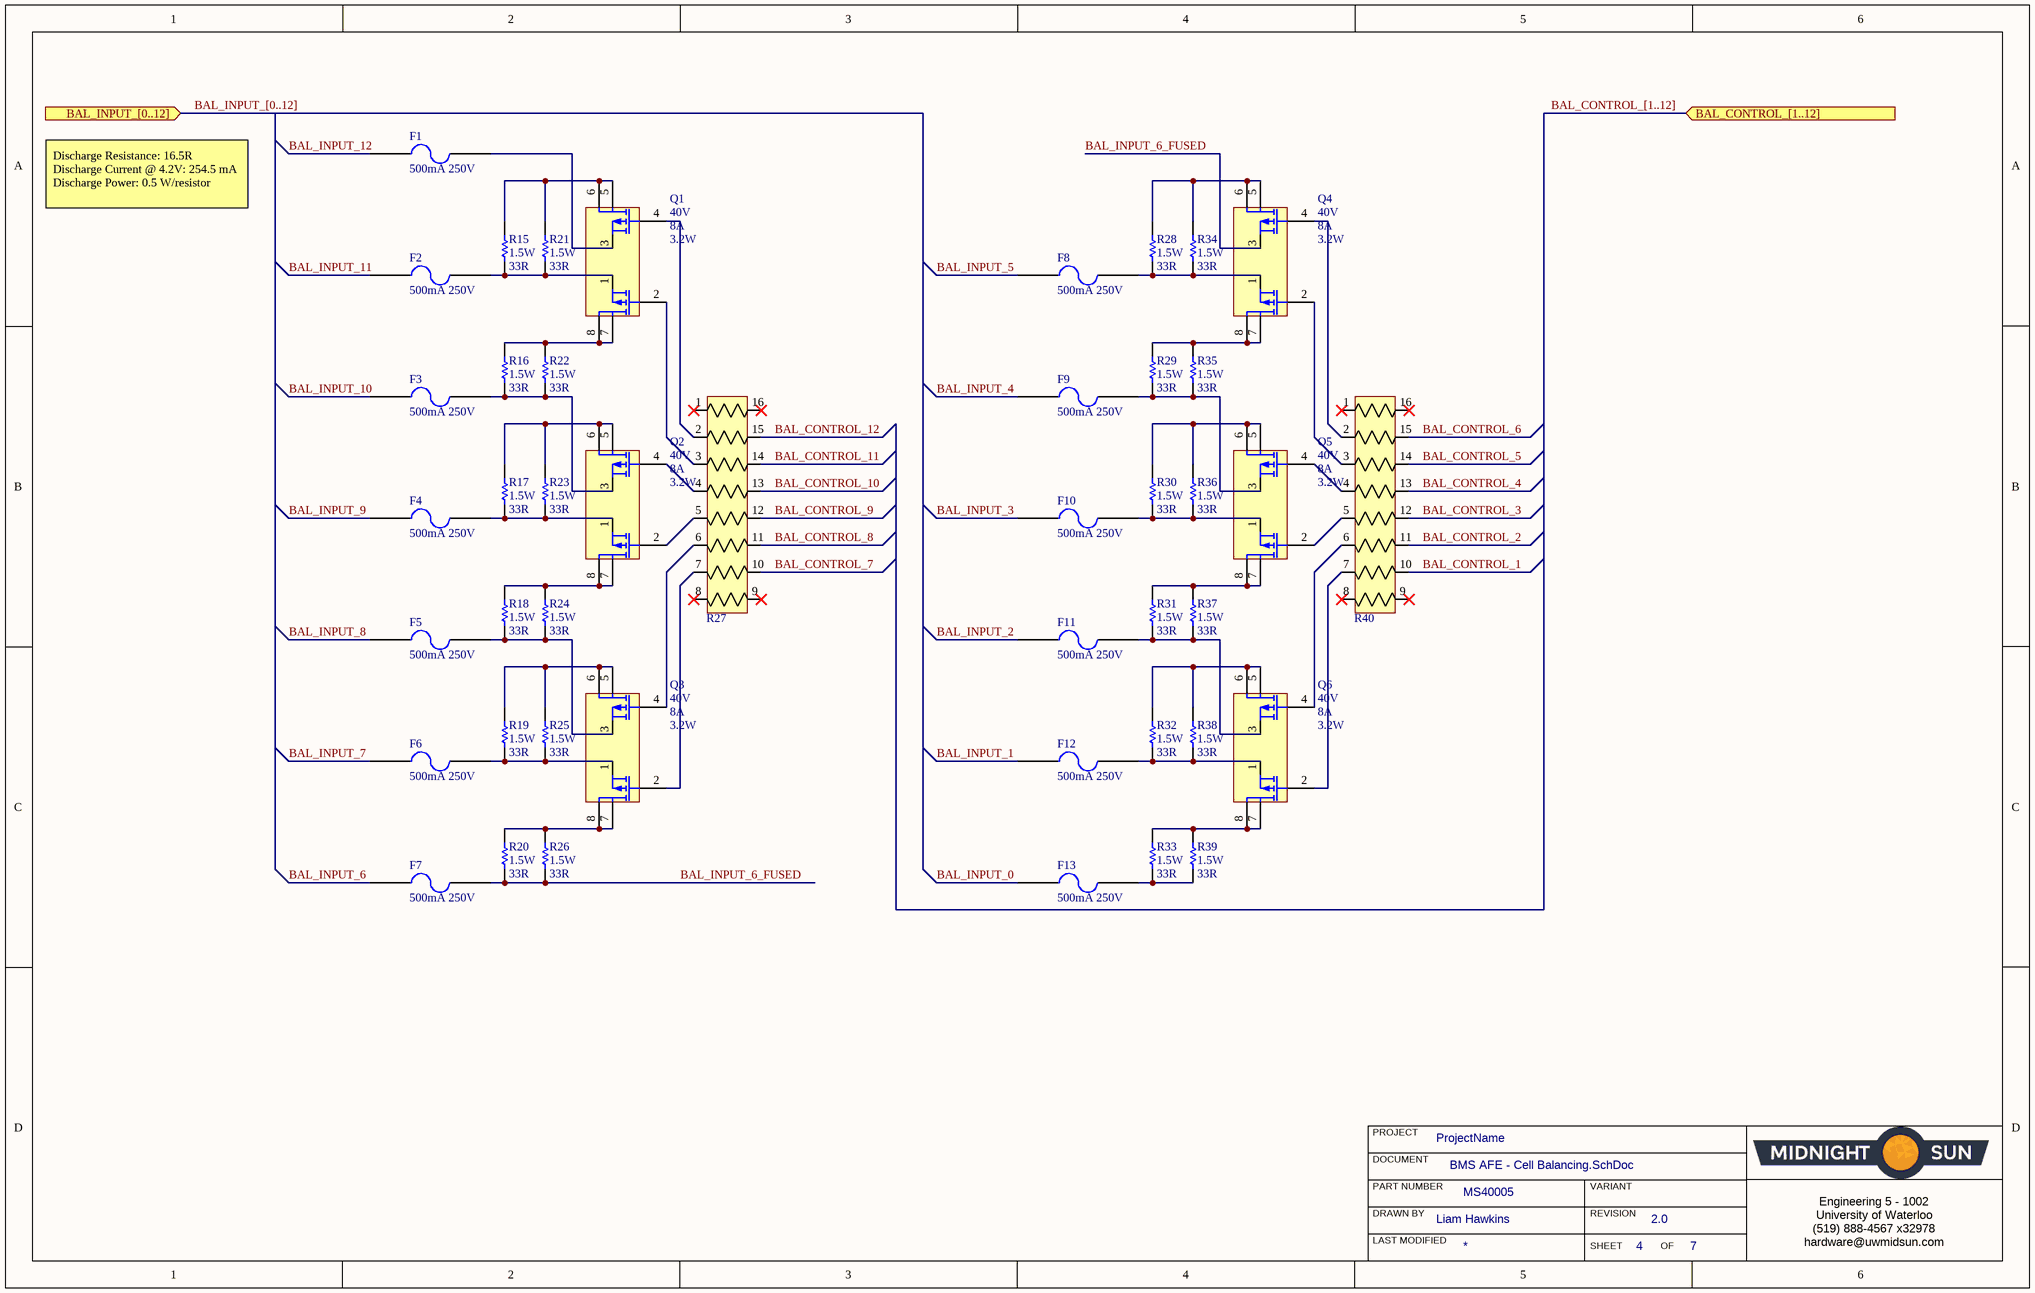
[diagram p2: BMS AFE - Cell Balancing.SchDoc]

### Parts
(Parts that share a designator on the sheet are numbered #1, #2 ... from top to bottom, then left to right.)
F1  500mA 250V  [FUSE JFC2410-0500FS]
F2  500mA 250V  [FUSE JFC2410-0500FS]
F3  500mA 250V  [FUSE JFC2410-0500FS]
F4  500mA 250V  [FUSE JFC2410-0500FS]
F5  500mA 250V  [FUSE JFC2410-0500FS]
F6  500mA 250V  [FUSE JFC2410-0500FS]
F7  500mA 250V  [FUSE JFC2410-0500FS]
F8  500mA 250V  [FUSE JFC2410-0500FS]
F9  500mA 250V  [FUSE JFC2410-0500FS]
F10  500mA 250V  [FUSE JFC2410-0500FS]
F11  500mA 250V  [FUSE JFC2410-0500FS]
F12  500mA 250V  [FUSE JFC2410-0500FS]
F13  500mA 250V  [FUSE JFC2410-0500FS]
Q1  Drain to Source Voltage (Vdss): 40V  Current - Continuous Drain (Id) @ 25°C: 8A  Power - Max: 3.2W  [SOIC8]  (hidden comment: MOSFET DUAL P-CH 40V 8A 3.2W 8-SOIC)
Q2  Drain to Source Voltage (Vdss): 40V  Current - Continuous Drain (Id) @ 25°C: 8A  Power - Max: 3.2W  [SOIC8]  (hidden comment: MOSFET DUAL P-CH 40V 8A 3.2W 8-SOIC)
Q3  Drain to Source Voltage (Vdss): 40V  Current - Continuous Drain (Id) @ 25°C: 8A  Power - Max: 3.2W  [SOIC8]  (hidden comment: MOSFET DUAL P-CH 40V 8A 3.2W 8-SOIC)
Q4  Drain to Source Voltage (Vdss): 40V  Current - Continuous Drain (Id) @ 25°C: 8A  Power - Max: 3.2W  [SOIC8]  (hidden comment: MOSFET DUAL P-CH 40V 8A 3.2W 8-SOIC)
Q5  Drain to Source Voltage (Vdss): 40V  Current - Continuous Drain (Id) @ 25°C: 8A  Power - Max: 3.2W  [SOIC8]  (hidden comment: MOSFET DUAL P-CH 40V 8A 3.2W 8-SOIC)
Q6  Drain to Source Voltage (Vdss): 40V  Current - Continuous Drain (Id) @ 25°C: 8A  Power - Max: 3.2W  [SOIC8]  (hidden comment: MOSFET DUAL P-CH 40V 8A 3.2W 8-SOIC)
R15  value 33R  Power (Watts): 1.5W  [RES STACKPOLE RPC2512 2512]  (hidden comment: RES 33 OHM 5% 1.5W 2512)
R16  value 33R  Power (Watts): 1.5W  [RES STACKPOLE RPC2512 2512]  (hidden comment: RES 33 OHM 5% 1.5W 2512)
R17  value 33R  Power (Watts): 1.5W  [RES STACKPOLE RPC2512 2512]  (hidden comment: RES 33 OHM 5% 1.5W 2512)
R18  value 33R  Power (Watts): 1.5W  [RES STACKPOLE RPC2512 2512]  (hidden comment: RES 33 OHM 5% 1.5W 2512)
R19  value 33R  Power (Watts): 1.5W  [RES STACKPOLE RPC2512 2512]  (hidden comment: RES 33 OHM 5% 1.5W 2512)
R20  value 33R  Power (Watts): 1.5W  [RES STACKPOLE RPC2512 2512]  (hidden comment: RES 33 OHM 5% 1.5W 2512)
R21  value 33R  Power (Watts): 1.5W  [RES STACKPOLE RPC2512 2512]  (hidden comment: RES 33 OHM 5% 1.5W 2512)
R22  value 33R  Power (Watts): 1.5W  [RES STACKPOLE RPC2512 2512]  (hidden comment: RES 33 OHM 5% 1.5W 2512)
R23  value 33R  Power (Watts): 1.5W  [RES STACKPOLE RPC2512 2512]  (hidden comment: RES 33 OHM 5% 1.5W 2512)
R24  value 33R  Power (Watts): 1.5W  [RES STACKPOLE RPC2512 2512]  (hidden comment: RES 33 OHM 5% 1.5W 2512)
R25  value 33R  Power (Watts): 1.5W  [RES STACKPOLE RPC2512 2512]  (hidden comment: RES 33 OHM 5% 1.5W 2512)
R26  value 33R  Power (Watts): 1.5W  [RES STACKPOLE RPC2512 2512]  (hidden comment: RES 33 OHM 5% 1.5W 2512)
R27  RES ARRAY 3.3K OHM 2% 16SOIC  [SOIC16]  (value not drawn)
R28  value 33R  Power (Watts): 1.5W  [RES STACKPOLE RPC2512 2512]  (hidden comment: RES 33 OHM 5% 1.5W 2512)
R29  value 33R  Power (Watts): 1.5W  [RES STACKPOLE RPC2512 2512]  (hidden comment: RES 33 OHM 5% 1.5W 2512)
R30  value 33R  Power (Watts): 1.5W  [RES STACKPOLE RPC2512 2512]  (hidden comment: RES 33 OHM 5% 1.5W 2512)
R31  value 33R  Power (Watts): 1.5W  [RES STACKPOLE RPC2512 2512]  (hidden comment: RES 33 OHM 5% 1.5W 2512)
R32  value 33R  Power (Watts): 1.5W  [RES STACKPOLE RPC2512 2512]  (hidden comment: RES 33 OHM 5% 1.5W 2512)
R33#2  value 33R  Power (Watts): 1.5W  [RES STACKPOLE RPC2512 2512]  (hidden comment: RES 33 OHM 5% 1.5W 2512)
R34#2  value 33R  Power (Watts): 1.5W  [RES STACKPOLE RPC2512 2512]  (hidden comment: RES 33 OHM 5% 1.5W 2512)
R35#2  value 33R  Power (Watts): 1.5W  [RES STACKPOLE RPC2512 2512]  (hidden comment: RES 33 OHM 5% 1.5W 2512)
R36#2  value 33R  Power (Watts): 1.5W  [RES STACKPOLE RPC2512 2512]  (hidden comment: RES 33 OHM 5% 1.5W 2512)
R37#2  value 33R  Power (Watts): 1.5W  [RES STACKPOLE RPC2512 2512]  (hidden comment: RES 33 OHM 5% 1.5W 2512)
R38#2  value 33R  Power (Watts): 1.5W  [RES STACKPOLE RPC2512 2512]  (hidden comment: RES 33 OHM 5% 1.5W 2512)
R39#2  value 33R  Power (Watts): 1.5W  [RES STACKPOLE RPC2512 2512]  (hidden comment: RES 33 OHM 5% 1.5W 2512)
R40#2  RES ARRAY 3.3K OHM 2% 16SOIC  [SOIC16]  (value not drawn)

### Ports
BAL_CONTROL_[1..12] (in), BAL_INPUT_[0..12] (in)

### Nets
BAL_CONTROL_1: R40#2.10
BAL_CONTROL_2: R40#2.11
BAL_CONTROL_3: R40#2.12
BAL_CONTROL_4: R40#2.13
BAL_CONTROL_5: R40#2.14
BAL_CONTROL_6: R40#2.15
BAL_CONTROL_7: R27.10
BAL_CONTROL_8: R27.11
BAL_CONTROL_9: R27.12
BAL_CONTROL_10: R27.13
BAL_CONTROL_11: R27.14
BAL_CONTROL_12: R27.15
BAL_INPUT_0: F13.1
BAL_INPUT_1: F12.1
BAL_INPUT_2: F11.1
BAL_INPUT_3: F10.1
BAL_INPUT_4: F9.1
BAL_INPUT_5: F8.1
BAL_INPUT_6: F7.1
BAL_INPUT_6_FUSED: F7.2 Q4.3(S2) R20.1 R26.1
BAL_INPUT_7: F6.1
BAL_INPUT_8: F5.1
BAL_INPUT_9: F4.1
BAL_INPUT_10: F3.1
BAL_INPUT_11: F2.1
BAL_INPUT_12: F1.1
NetF1_2: F1.2 Q1.3(S2)
NetF2_2: F2.2 Q1.1(S1) R15.1 R21.1
NetF3_2: F3.2 Q2.3(S2) R16.1 R22.1
NetF4_2: F4.2 Q2.1(S1) R17.1 R23.1
NetF5_2: F5.2 Q3.3(S2) R18.1 R24.1
NetF6_2: F6.2 Q3.1(S1) R19.1 R25.1
NetF8_2: F8.2 Q4.1(S1) R28.1 R34#2.1
NetF9_2: F9.2 Q5.3(S2) R29.1 R35#2.1
NetF10_2: F10.2 Q5.1(S1) R30.1 R36#2.1
NetF11_2: F11.2 Q6.3(S2) R31.1 R37#2.1
NetF12_2: F12.2 Q6.1(S1) R32.1 R38#2.1
NetF13_2: F13.2 R33#2.1 R39#2.1
NetQ1_2: Q1.2(G1) R27.3
NetQ1_4: Q1.4(G2) R27.2
NetQ1_5: Q1.5(D2) Q1.6(D2) R15.2 R21.2
NetQ1_7: Q1.7(D1) Q1.8(D1) R16.2 R22.2
NetQ2_2: Q2.2(G1) R27.5
NetQ2_4: Q2.4(G2) R27.4
NetQ2_5: Q2.5(D2) Q2.6(D2) R17.2 R23.2
NetQ2_7: Q2.7(D1) Q2.8(D1) R18.2 R24.2
NetQ3_2: Q3.2(G1) R27.7
NetQ3_4: Q3.4(G2) R27.6
NetQ3_5: Q3.5(D2) Q3.6(D2) R19.2 R25.2
NetQ3_7: Q3.7(D1) Q3.8(D1) R20.2 R26.2
NetQ4_2: Q4.2(G1) R40#2.3
NetQ4_4: Q4.4(G2) R40#2.2
NetQ4_5: Q4.5(D2) Q4.6(D2) R28.2 R34#2.2
NetQ4_7: Q4.7(D1) Q4.8(D1) R29.2 R35#2.2
NetQ5_2: Q5.2(G1) R40#2.5
NetQ5_4: Q5.4(G2) R40#2.4
NetQ5_5: Q5.5(D2) Q5.6(D2) R30.2 R36#2.2
NetQ5_7: Q5.7(D1) Q5.8(D1) R31.2 R37#2.2
NetQ6_2: Q6.2(G1) R40#2.7
NetQ6_4: Q6.4(G2) R40#2.6
NetQ6_5: Q6.5(D2) Q6.6(D2) R32.2 R38#2.2
NetQ6_7: Q6.7(D1) Q6.8(D1) R33#2.2 R39#2.2

Not connected (* = marked no-connect by the designer): R27 1* 8* 9* 16*; R40#2 1* 8* 9* 16*

### Buses and harness runs
bus BAL_CONTROL_[1..12] = port BAL_CONTROL_[1..12]
bus BAL_INPUT_[0..12] = port BAL_INPUT_[0..12]

### Notes on the sheet
- Discharge Resistance: 16.5R
  Discharge Current @ 4.2V: 254.5 mA
  Discharge Power: 0.5 W/resistor
- PROJECT
- DOCUMENT
- DRAWN BY
- LAST MODIFIED
- PART NUMBER
- REVISION
- SHEET
- VARIANT
- OF
- Engineering 5 - 1002
  University of Waterloo
  (519) 888-4567 x32978
  hardware@uwmidsun.com

### Library data of the parts
F1-F13 = FUSE 500MA LCSC: 2410 Surface Mount Fuses RoHS; Manufacturer 1: Shenzen JDT Fuse; Manufacturer Part Number 1: JFC2410-0500FS; ComponentLink1Description: Shenzhen JDT Fuse; ComponentLink1URL: https://datasheet.lcsc.com/szlcsc/1809211424_Shenzhen-JDT-Fuse-JFC2410-0500FS_C136360.pdf; Supplier 1: LCSC; Supplier Part Number 1: C136360; Pricing 1: 1=0.0591USD
Q1-Q6 = MOSFET DUAL P-CH 40V 8A 3.2W 8-SOIC: Mosfet Array 2 P-Channel (Dual) 40V 8A 3.2W Surface Mount 8-SO; Manufacturer 1: Vishay Siliconix; Manufacturer Part Number 1: SI4909DY-T1-GE3; Description 1: MOSFET 2P-CH 40V 8A 8SO; FET Feature: Logic Level Gate; Rds On (Max) @ Id, Vgs: 27 mOhm @ 8A, 10V; Vgs(th) (Max) @ Id: 2.5V @ 250µA; Gate Charge (Qg) (Max) @ Vgs: 63nC @ 10V; Input Capacitance (Ciss) (Max) @ Vds: 2000pF @ 20V; Supplier 1: Digi-Key; Supplier Part Number 1: SI4909DY-T1-GE3CT-ND; RoHS: RoHS Compliant; Category: Discrete Semiconductor Products; Stock 1: 11582; Pricing 1: 1=1.57, 10=1.407, 25=1.3352, 100=1.0969, 250=1.02536, 500=0.90614, 1000=0.71538 (CAD); Packaging: Cut Tape (CT); Part Status: Active; FET Type: 2 P-Channel (Dual); Operating Temperature: -55°C ~ 150°C (TJ); Mounting Type: Surface Mount; Package / Case: 8-SOIC (0.154", 3.90mm Width); Supplier Device Package: 8-SO; ComponentLink1URL: http://www.vishay.com/docs/67077/si4909dy.pdf; ComponentLink1Description: http://www.vishay.com/docs/67077/si4909dy.pdf
R15-R26 R28-R32 R33#2 R34#2 R35#2 R36#2 R37#2 R38#2 R39#2 = RES 33 OHM 5% 1.5W 2512: 33 Ohms ±5% 1.5W Chip Resistor 2512 (6432 Metric) Automotive AEC-Q200, Pulse Withstanding Thick Film; Manufacturer: Stackpole Electronics Inc.; Manufacturer Part Number: RPC2512JT33R0; Temperature Coefficient: ±100ppm/°C; Supplier 1: Digi-Key; RoHS: RoHS Compliant; Category: Resistors; Stock 1: 28556; Pricing 1: 1=0.88, 10=0.632, 100=0.3284, 1000=0.17685 (CAD); Packaging: Cut Tape (CT); Part Status: Active; Composition: Thick Film; Features: Automotive AEC-Q200, Pulse Withstanding; Operating Temperature: -55°C ~ 155°C; Package / Case: 2512 (6432 Metric); Supplier Device Package: 2512; Size / Dimension: 0.250" L x 0.122" W (6.35mm x 3.10mm); Height - Seated (Max): 0.026" (0.65mm); Failure Rate: -; ComponentLink1URL: https://www.seielect.com/Catalog/SEI-rpc.pdf; ComponentLink1Description: https://www.seielect.com/Catalog/SEI-rpc.pdf; Supplier Part Number 1: RPC2512JT33R0CT-ND; Tolerance: ±5%
R27 R40#2 = RES ARRAY 3.3K OHM 2% 16SOIC: 3.3k Ohm ±2% 160mW Power Per Element Isolated  Resistor Network/Array ±100ppm/°C 16-SOIC (0.220", 5.59mm Width); Manufacturer: Bourns; Manufacturer Part Number: 4816P-1-332LF; Resistance: 3.3kR; Power Rating: 1.28W; Number of Resistors: 8; Voltage Rating (DC): 50V; Mount: Surface Mount; Case/Package: SOIC; Number of Pins: 16; Number of Terminals: 16; Min Operating Temperature: -55°C; Max Operating Temperature: 125°C; Packaging: Tape and Reel; Tolerance: 2%; Package Quantity: 1; Circuit Type: Isolated; Power Per Element: 160mW; Termination: Gull Wing; Military Standard: Not; Temperature Coefficient: 100ppm/°C; Length: 0.44inch; Height: 0.085inch; Width: 0.22inch; Lead Pitch: 1.27mm; Terminal Pitch: 1.27mm; Depth: 7.62mm; Radiation Hardening: No; ComponentLink1URL: https://datasheet.ciiva.com/6494/4800p-6494310.pdf?src-supplier=Digi-Key; ComponentLink1Description: https://datasheet.ciiva.com/6494/4800p-6494310.pdf?src-supplier=Digi-Key; ComponentLink2URL: https://datasheet.ciiva.com/6494/4800p-6494312.pdf?src-supplier=Digi-Key; ComponentLink2Description: https://datasheet.ciiva.com/6494/4800p-6494312.pdf?src-supplier=Digi-Key; ComponentLink3URL: https://datasheet.ciiva.com/16826/4800p-16826713.pdf?src-supplier=Avnet+Europe; ComponentLink3Description: https://datasheet.ciiva.com/16826/4800p-16826713.pdf?src-supplier=Avnet+Europe; ComponentLink4URL: https://datasheet.ciiva.com/6494/4800p-6494315.pdf?src-supplier=Digi-Key; ComponentLink4Description: https://datasheet.ciiva.com/6494/4800p-6494315.pdf?src-supplier=Digi-Key; ComponentLink5URL: https://datasheet.ciiva.com/8370/4800p-8370733.pdf?src-supplier=Avnet; ComponentLink5Description: https://datasheet.ciiva.com/8370/4800p-8370733.pdf?src-supplier=Avnet; Pricing 1: 1=1.31000, 10=1.15900, 25=1.06600, 50=0.97240, 100=0.84150, 250=0.71060, 500=0.59840, 1000=0.49742 (USD); RoHS: Yes; Stock 1: 3189; Supplier 1: Digi-Key; Supplier Part Number 1: 4816P-1-332LFCT-ND

## Sheet BMS AFE - Cell Inputs.SchDoc: Title
size B; Organization: Midnight Sun Solar Rayce Car Team; Address1: University of Waterloo; Address2: 200 University Ave W; Address3: Waterloo, ON, Canada; Address4: N2L 3E9; DocumentNumber: 3; SheetNumber: 3; SheetTotal: 8; Website: www.uwmidsun.com; ProjectName: ProjectName
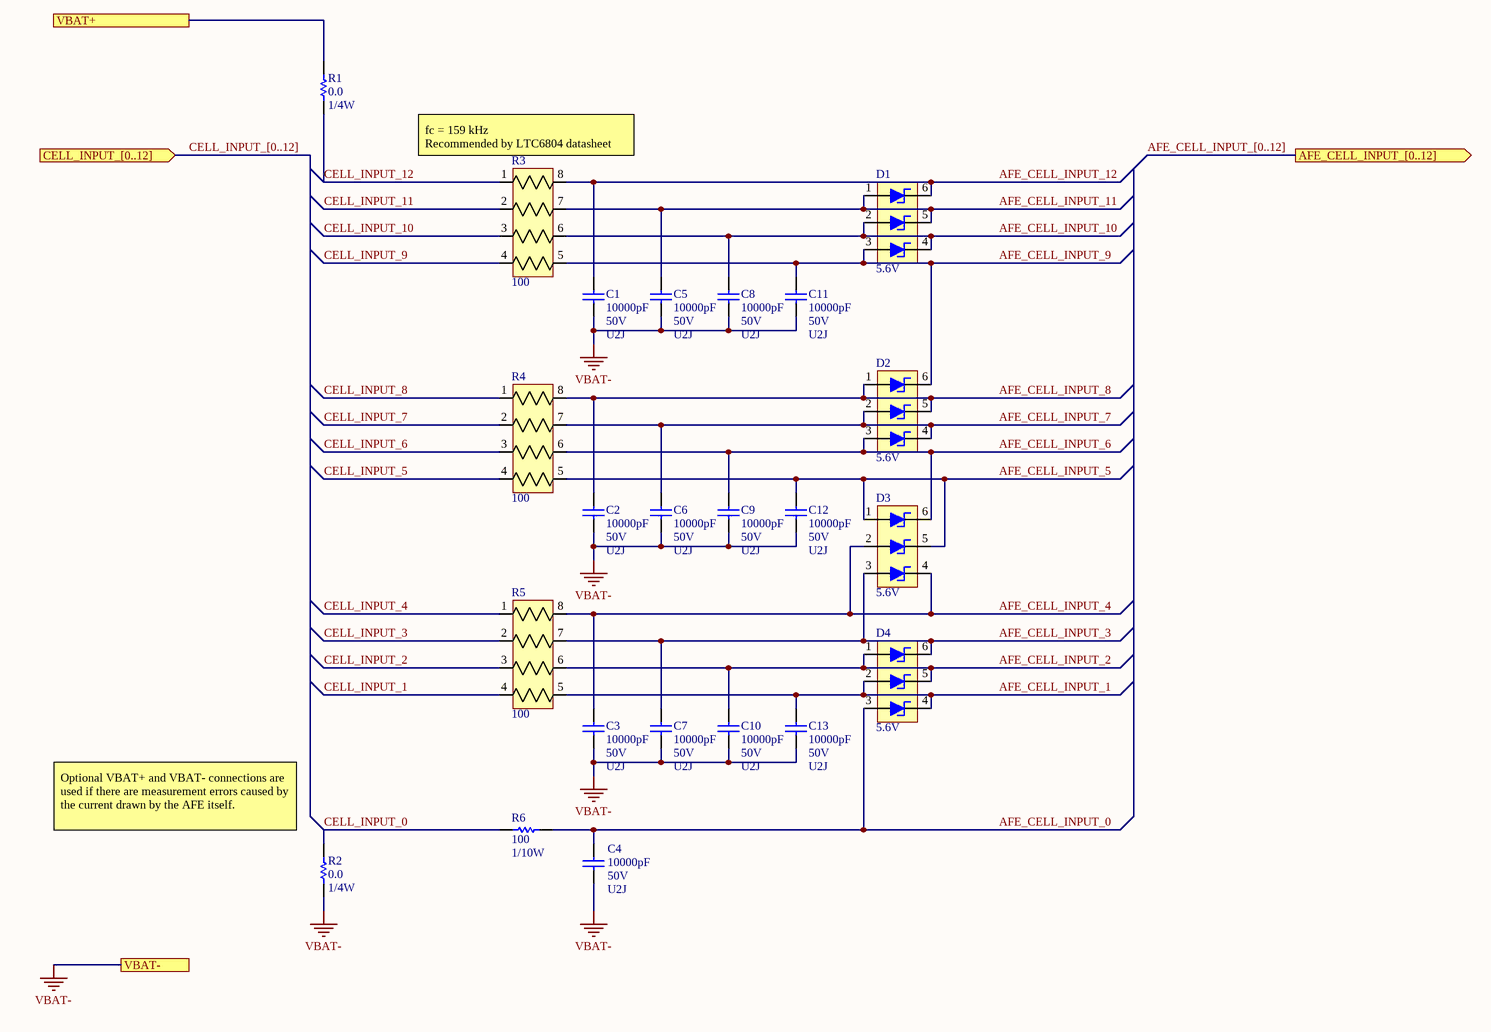
[diagram p3: BMS AFE - Cell Inputs.SchDoc]

### Parts
C1  Capacitance: 10000pF  Voltage: 50V  Temperature Coefficient: U2J  [CAP, 0603]  (hidden comment: CAP CER 10nF 50V 5% X7R 0603)
C2  Capacitance: 10000pF  Voltage: 50V  Temperature Coefficient: U2J  [CAP, 0603]  (hidden comment: CAP CER 10nF 50V 5% X7R 0603)
C3  Capacitance: 10000pF  Voltage: 50V  Temperature Coefficient: U2J  [CAP, 0603]  (hidden comment: CAP CER 10nF 50V 5% X7R 0603)
C4  Capacitance: 10000pF  Voltage: 50V  Temperature Coefficient: U2J  [CAP, 0603]  (hidden comment: CAP CER 10nF 50V 5% X7R 0603)
C5  Capacitance: 10000pF  Voltage: 50V  Temperature Coefficient: U2J  [CAP, 0603]  (hidden comment: CAP CER 10nF 50V 5% X7R 0603)
C6  Capacitance: 10000pF  Voltage: 50V  Temperature Coefficient: U2J  [CAP, 0603]  (hidden comment: CAP CER 10nF 50V 5% X7R 0603)
C7  Capacitance: 10000pF  Voltage: 50V  Temperature Coefficient: U2J  [CAP, 0603]  (hidden comment: CAP CER 10nF 50V 5% X7R 0603)
C8  Capacitance: 10000pF  Voltage: 50V  Temperature Coefficient: U2J  [CAP, 0603]  (hidden comment: CAP CER 10nF 50V 5% X7R 0603)
C9  Capacitance: 10000pF  Voltage: 50V  Temperature Coefficient: U2J  [CAP, 0603]  (hidden comment: CAP CER 10nF 50V 5% X7R 0603)
C10  Capacitance: 10000pF  Voltage: 50V  Temperature Coefficient: U2J  [CAP, 0603]  (hidden comment: CAP CER 10nF 50V 5% X7R 0603)
C11  Capacitance: 10000pF  Voltage: 50V  Temperature Coefficient: U2J  [CAP, 0603]  (hidden comment: CAP CER 10nF 50V 5% X7R 0603)
C12  Capacitance: 10000pF  Voltage: 50V  Temperature Coefficient: U2J  [CAP, 0603]  (hidden comment: CAP CER 10nF 50V 5% X7R 0603)
C13  Capacitance: 10000pF  Voltage: 50V  Temperature Coefficient: U2J  [CAP, 0603]  (hidden comment: CAP CER 10nF 50V 5% X7R 0603)
D1  5.6V  [SOT-363]
D2  5.6V  [SOT-363]
D3  5.6V  [SOT-363]
D4  5.6V  [SOT-363]
R1  Resistance: 0.0  Power (Watts): 1/4W  [RES, 0603]  (hidden comment: RES 0.0 OHM 1/4W 0603)
R2  Resistance: 0.0  Power (Watts): 1/4W  [RES, 0603]  (hidden comment: RES 0.0 OHM 1/4W 0603)
R3  Resistance: 100  [RES ARRAY 4RES 1206]  (hidden comment: RES ARRAY 100 OHM 0.5% 4RES 1206)
R4  Resistance: 100  [RES ARRAY 4RES 1206]  (hidden comment: RES ARRAY 100 OHM 0.5% 4RES 1206)
R5  Resistance: 100  [RES ARRAY 4RES 1206]  (hidden comment: RES ARRAY 100 OHM 0.5% 4RES 1206)
R6  Resistance: 100  Power: 1/10W  [RES, 0603]  (hidden comment: RES 100 OHM 1% 1/10W 0603)

### Ports
AFE_CELL_INPUT_[0..12] (out), CELL_INPUT_[0..12] (in), VBAT+, VBAT-

### Nets
VBAT+: R1.1 ; port VBAT+
VBAT-: C1.2 C2.2 C3.2 C4.2 C5.2 C6.2 C7.2 C8.2 C9.2 C10.2 C11.2 C12.2 C13.2 R2.2 ; port VBAT-
AFE_CELL_INPUT_0: C4.1 D4.3(A3) R6.2
AFE_CELL_INPUT_1: C13.1 D4.2(A2) D4.4(C3) R5.5
AFE_CELL_INPUT_2: C10.1 D4.1(A1) D4.5(C2) R5.6
AFE_CELL_INPUT_3: C7.1 D3.3(A3) D4.6(C1) R5.7
AFE_CELL_INPUT_4: C3.1 D3.2(A2) D3.4(C3) R5.8
AFE_CELL_INPUT_5: C12.1 D3.1(A1) D3.5(C2) R4.5
AFE_CELL_INPUT_6: C9.1 D2.3(A3) D3.6(C1) R4.6
AFE_CELL_INPUT_7: C6.1 D2.2(A2) D2.4(C3) R4.7
AFE_CELL_INPUT_8: C2.1 D2.1(A1) D2.5(C2) R4.8
AFE_CELL_INPUT_9: C11.1 D1.3(A3) D2.6(C1) R3.5
AFE_CELL_INPUT_10: C8.1 D1.2(A2) D1.4(C3) R3.6
AFE_CELL_INPUT_11: C5.1 D1.1(A1) D1.5(C2) R3.7
AFE_CELL_INPUT_12: C1.1 D1.6(C1) R3.8
CELL_INPUT_0: R2.1 R6.1
CELL_INPUT_1: R5.4
CELL_INPUT_2: R5.3
CELL_INPUT_3: R5.2
CELL_INPUT_4: R5.1
CELL_INPUT_5: R4.4
CELL_INPUT_6: R4.3
CELL_INPUT_7: R4.2
CELL_INPUT_8: R4.1
CELL_INPUT_9: R3.4
CELL_INPUT_10: R3.3
CELL_INPUT_11: R3.2
CELL_INPUT_12: R1.2 R3.1

### Buses and harness runs
bus AFE_CELL_INPUT_[0..12] = port AFE_CELL_INPUT_[0..12]
bus CELL_INPUT_[0..12] = port CELL_INPUT_[0..12]

### Notes on the sheet
- (near R3) fc = 159 kHz
  Recommended by LTC6804 datasheet
- (near R2) Optional VBAT+ and VBAT- connections are used if there are measurement errors caused by the current drawn by the AFE itself.
- PROJECT
- DOCUMENT
- DRAWN BY
- LAST MODIFIED
- PART NUMBER
- REVISION
- SHEET
- VARIANT
- OF
- Engineering 5 - 1002
  University of Waterloo
  (519) 888-4567 x32978
  hardware@uwmidsun.com

### Library data of the parts
C1-C13 = CAP CER 10nF 50V 5% X7R 0603: 10000pF ±5% 50V Ceramic Capacitor U2J 0603 (1608 Metric); Manufacturer 1: KEMET; Manufacturer Part Number 1: C0603C103J5JAC7867; Supplier 1: Digi-Key; Supplier Part Number 1: 399-13384-1-ND; Packaging: Cut Tape (CT); Part Status: Active; Operating Temperature: -55°C ~ 125°C; Ratings: -; Failure Rate: -; Mounting Type: Surface Mount, MLCC; Package / Case: 0603 (1608 Metric); Size / Dimension: 0.063" L x 0.032" W (1.60mm x 0.80mm); Height - Seated (Max): -; Thickness (Max): 0.034" (0.87mm); Lead Spacing: -; Lead Style: -; ComponentLink1URL: http://www.kemet.com/docfinder?Partnumber=C0603C103J5JAC7867; ComponentLink1Description: http://www.kemet.com/docfinder?Partnumber=C0603C103J5JAC7867; Tolerance: ±5%
D1-D4 = DIODE ZENER ARRAY 5.6V SOT363: Zener Diode Array 3 Independent 5.6V 200mW ±6% SOT-363; Manufacturer: Diodes; Manufacturer Part Number: BZX84C5V6TS-7-F; Voltage Tolerance: 7.14%; Impedance: 40R; Peak Reverse Current: 1uA; Test Current: 5mA; Forward Voltage: 900mV; ESD Protection: No; Mount: Surface Mount; Case/Package: SOT-363; Number of Pins: 6; Weight: 0.000212oz; Contact Plating: Tin,Matte; Min Operating Temperature: -65°C; Max Operating Temperature: 150°C; Max Power Dissipation: 200mW; Zener Voltage: 5.6V; Packaging: Tape and Reel; Package Quantity: 3000; Max Reverse Leakage Current: 1uA; Power Dissipation: 200mW; Tolerance: 6%; Zener Current: 1uA; Power Rating: 200mW; Voltage Rating (DC): 5.6V; Length: 2.2mm; Height: 1mm; Width: 2.2mm; Lead Free: Lead Free; ComponentLink1URL: https://datasheet.ciiva.com/10642/ds30187-10642567.pdf?src-supplier=Avnet; ComponentLink1Description: https://datasheet.ciiva.com/10642/ds30187-10642567.pdf?src-supplier=Avnet; ComponentLink2URL: https://datasheet.ciiva.com/17267/ds30187-17267470.pdf?src-supplier=Avnet+Europe; ComponentLink2Description: https://datasheet.ciiva.com/17267/ds30187-17267470.pdf?src-supplier=Avnet+Europe; Supplier 1: Digi-Key; Supplier Part Number 1: BZX84C5V6TS-FDICT-ND; Pricing 1: 1=0.42000, 10=0.31700, 100=0.15080, 500=0.13364, 1000=0.10400 (USD); RoHS: Yes; Stock 1: 3211
R1 R2 = RES 0.0 OHM 1/4W 0603: as R40#1 on sheet BMS AFE - AFE; Supplier 1: Digi-Key; Supplier Part Number 1: 541-0.0SBCT-ND; Packaging: Cut Tape (CT); Part Status: Active; Composition: Thick Film; Operating Temperature: -55°C ~ 155°C; Package / Case: 0603 (1608 Metric); Supplier Device Package: 0603; Size / Dimension: 0.063" L x 0.033" W (1.60mm x 0.85mm); Height - Seated (Max): 0.022" (0.55mm); Failure Rate: -; ComponentLink1URL: http://www.vishay.com/docs/20043/crcwhpe3.pdf; ComponentLink1Description: http://www.vishay.com/docs/20043/crcwhpe3.pdf
R3-R5 = RES ARRAY 100 OHM 0.5% 4RES 1206: 100 Ohm ±0.5% 100mW Power Per Element Isolated 4 Resistor Network/Array ±50ppm/°C 1206 (3216 Metric), Convex, Long Side Terminals; Manufacturer: Vishay Beyschlag; Manufacturer Part Number: ACASA1002S1002P100; Number of Resistors: 4; Power Rating: 300mW; RoHS: RoHS Compliant; Category: Resistors; Packaging: Cut Tape (CT); Part Status: Active; Circuit Type: Isolated; Power Per Element: 100mW; Temperature Coefficient: ±50ppm/°C; Operating Temperature: -55°C ~ 125°C; Applications: Voltage Divider (TCR Matched); Mounting Type: Surface Mount; Package / Case: 1206 (3216 Metric), Convex, Long Side Terminals; Supplier Device Package: 0612; Size / Dimension: 0.126" L x 0.059" W (3.20mm x 1.50mm); Height - Seated (Max): 0.022" (0.55mm); Mount: Surface Mount; Case/Package: 0612; Number of Pins: 8; Weight: 0.000233oz; Number of Terminals: 8; Case Code (Metric): 3216; Case Code (Imperial): 1206; Min Operating Temperature: -55°C; Max Operating Temperature: 125°C; Package Quantity: 1; Termination: Convex; Military Standard: Not; Length: 1.5mm; Height: 0.55mm; Width: 3.2mm; Depth: 1.5mm; Terminal Pitch: 0.8mm; Radiation Hardening: No; ComponentLink3URL: https://datasheet.ciiva.com/8336/acaprof-8336568.pdf?src-supplier=Avnet; ComponentLink3Description: https://datasheet.ciiva.com/8336/acaprof-8336568.pdf?src-supplier=Avnet; Tolerance: ±0.5%; Pricing 1: 1=0.74000, 10=0.54700, 25=0.44400, 50=0.38620, 100=0.31850, 250=0.27672, 500=0.22522 (USD); Stock 1: 5815; Supplier 1: Digi-Key; Supplier Part Number 1: ACASA-100/100-2CT-ND
R6 = RES 100 OHM 1% 1/10W 0603: as R38#1 on sheet BMS AFE - AFE; Supplier 1: Digi-Key; Supplier Part Number 1: 311-100HRCT-ND; Packaging: Cut Tape (CT); Part Status: Active; Composition: Thick Film; Operating Temperature: -55°C ~ 155°C; Package / Case: 0603 (1608 Metric); Supplier Device Package: 0603; Size / Dimension: 0.063" L x 0.031" W (1.60mm x 0.80mm); Height - Seated (Max): 0.022" (0.55mm); Failure Rate: -; ComponentLink1URL: http://www.yageo.com/documents/recent/PYu-RC_Group_51_RoHS_L_7.pdf; ComponentLink1Description: http://www.yageo.com/documents/recent/PYu-RC_Group_51_RoHS_L_7.pdf; Tolerance: ±1%

## Sheet BMS AFE - Communications.SchDoc: Title
size B; Organization: Midnight Sun Solar Rayce Car Team; Address1: University of Waterloo; Address2: 200 University Ave W; Address3: Waterloo, ON, Canada; Address4: N2L 3E9; DocumentNumber: 6; SheetNumber: 6; SheetTotal: 7; Website: www.uwmidsun.com; ProjectName: ProjectName
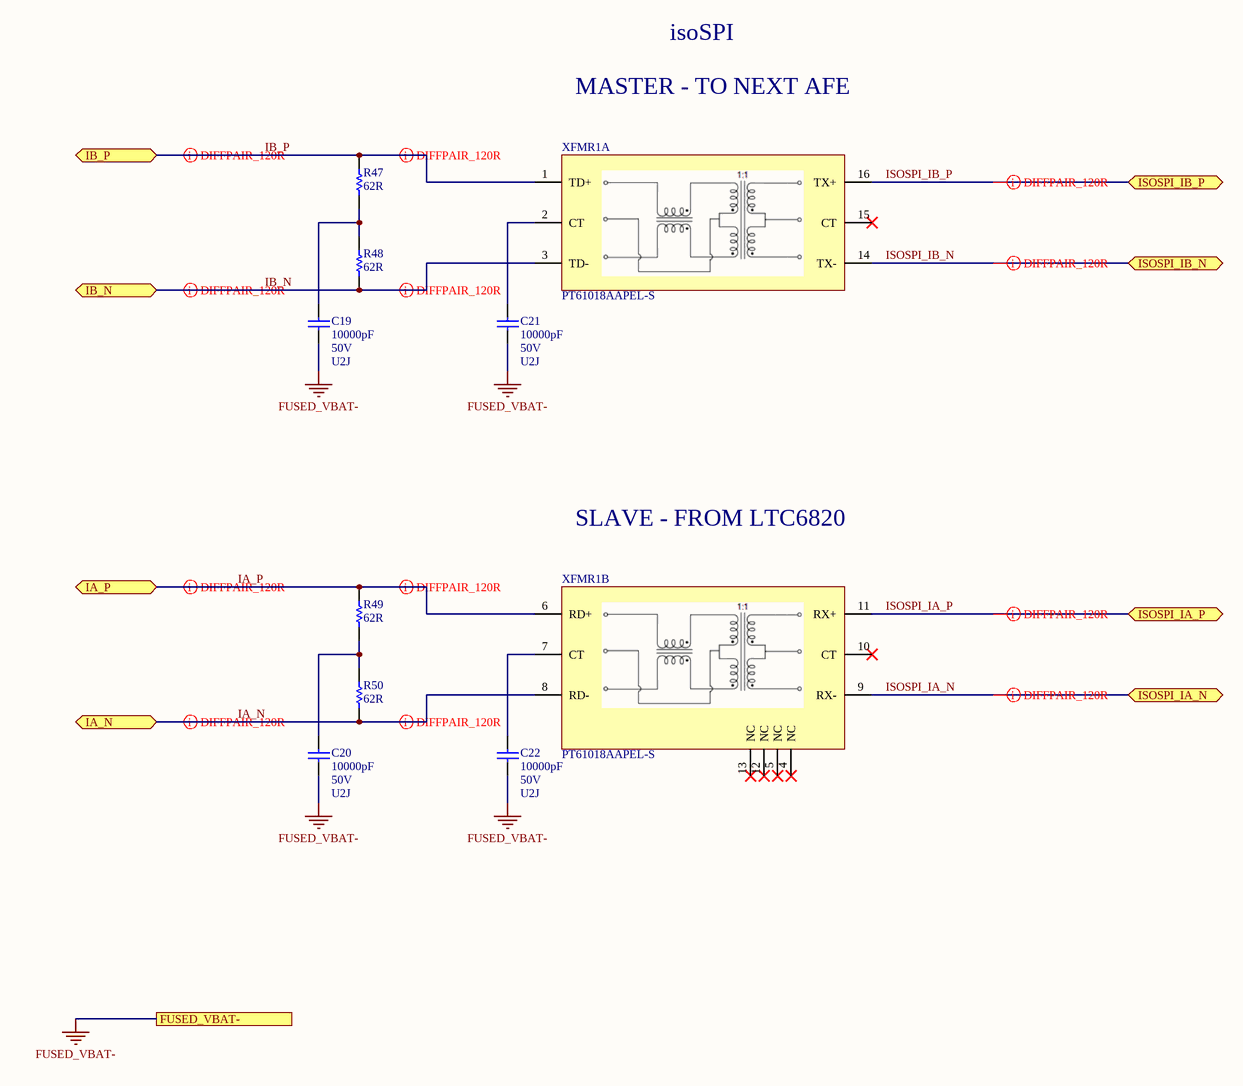
[diagram p4: BMS AFE - Communications.SchDoc]

### Parts
C19  Capacitance: 10000pF  Voltage: 50V  Temperature Coefficient: U2J  [CAP, 0603]  (hidden comment: CAP CER 10nF 50V 5% X7R 0603)
C20  Capacitance: 10000pF  Voltage: 50V  Temperature Coefficient: U2J  [CAP, 0603]  (hidden comment: CAP CER 10nF 50V 5% X7R 0603)
C21  Capacitance: 10000pF  Voltage: 50V  Temperature Coefficient: U2J  [CAP, 0603]  (hidden comment: CAP CER 10nF 50V 5% X7R 0603)
C22  Capacitance: 10000pF  Voltage: 50V  Temperature Coefficient: U2J  [CAP, 0603]  (hidden comment: CAP CER 10nF 50V 5% X7R 0603)
R47  62R  [RES, 0603]
R48  62R  [RES, 0603]
R49  62R  [RES, 0603]
R50  62R  [RES, 0603]
XFMR1  MFG_PN: PT61018AAPEL-S  [IC, PULSE XFMR 1CT:1CT 350UH SMD]  (hidden comment: IC PULSE XFMR 1CT:1CT 350UH SMD)  (parts A,B of 2)

### Ports
FUSED_VBAT-, IA_N (bidir), IA_P (bidir), IB_N (bidir), IB_P (bidir), ISOSPI_IA_N (bidir), ISOSPI_IA_P (bidir), ISOSPI_IB_N (bidir), ISOSPI_IB_P (bidir)

### Nets
FUSED_VBAT-: C19.2 C20.2 C21.2 C22.2 ; port FUSED_VBAT-
IA_N: R50.2 XFMR1.8(RD-) ; port IA_N
IA_P: R49.1 XFMR1.6(RD+) ; port IA_P
IB_N: R48.2 XFMR1.3(TD-) ; port IB_N
IB_P: R47.1 XFMR1.1(TD+) ; port IB_P
ISOSPI_IA_N: XFMR1.9(RX-) ; port ISOSPI_IA_N
ISOSPI_IA_P: XFMR1.11(RX+) ; port ISOSPI_IA_P
ISOSPI_IB_N: XFMR1.14(TX-) ; port ISOSPI_IB_N
ISOSPI_IB_P: XFMR1.16(TX+) ; port ISOSPI_IB_P
NetC19_1: C19.1 R47.2 R48.1
NetC20_1: C20.1 R49.2 R50.1
NetC21_1: C21.1 XFMR1.2(CT)
NetC22_1: C22.1 XFMR1.7(CT)

Not connected (* = marked no-connect by the designer): XFMR1 4(NC)* 5(NC)* 10(CT)* 12(NC)* 13(NC)* 15(CT)*

### Layout directives
differential pair: IA_N, IA_P, IB_N, IB_P, ISOSPI_IA_N, ISOSPI_IA_P, ISOSPI_IB_N, ISOSPI_IB_P

### Notes on the sheet
- MASTER - TO NEXT AFE
- isoSPI
- SLAVE - FROM LTC6820
- PROJECT
- DOCUMENT
- DRAWN BY
- LAST MODIFIED
- PART NUMBER
- REVISION
- SHEET
- VARIANT
- OF
- Engineering 5 - 1002
  University of Waterloo
  (519) 888-4567 x32978
  hardware@uwmidsun.com

### Library data of the parts
C19-C22 = CAP CER 10nF 50V 5% X7R 0603: as C1 on sheet BMS AFE - Cell Inputs; Supplier 1: Digi-Key; Supplier Part Number 1: 399-13384-1-ND; Packaging: Cut Tape (CT); Part Status: Active; Operating Temperature: -55°C ~ 125°C; Ratings: -; Failure Rate: -; Mounting Type: Surface Mount, MLCC; Package / Case: 0603 (1608 Metric); Size / Dimension: 0.063" L x 0.032" W (1.60mm x 0.80mm); Height - Seated (Max): -; Thickness (Max): 0.034" (0.87mm); Lead Spacing: -; Lead Style: -; ComponentLink1URL: http://www.kemet.com/docfinder?Partnumber=C0603C103J5JAC7867; ComponentLink1Description: http://www.kemet.com/docfinder?Partnumber=C0603C103J5JAC7867; Tolerance: ±5%
R47-R50 = RES 62 OHM 0.1% 1/10W 0603: 62 Ohms ±0.1% 0.1W, 1/10W Chip Resistor 0603 (1608 Metric) Automotive AEC-Q200 Thin Film; Manufacturer: Panasonic Electronic Components; Manufacturer Part Number: ERA-3AEB620V; Temperature Coefficient: ±25ppm/°C; Supplier 1: Digi-Key; RoHS: RoHS Compliant; Category: Resistors; Stock 1: 10320; Pricing 1: 1=0.52, 10=0.447, 100=0.1748, 1000=0.07317, 2500=0.06708 (CAD); Packaging: Cut Tape (CT); Part Status: Active; Tolerance: ±0.1%; Power (Watts): 0.1W, 1/10W; Composition: Thin Film; Features: Automotive AEC-Q200; Operating Temperature: -55°C ~ 155°C; Package / Case: 0603 (1608 Metric); Supplier Device Package: 0603; Size / Dimension: 0.063" L x 0.032" W (1.60mm x 0.80mm); Height - Seated (Max): 0.022" (0.55mm); Failure Rate: -; ComponentLink1URL: https://industrial.panasonic.com/cdbs/www-data/pdf/RDM0000/AOA0000C307.pdf; ComponentLink1Description: https://industrial.panasonic.com/cdbs/www-data/pdf/RDM0000/AOA0000C307.pdf; Supplier Part Number 1: P62DBCT-ND
XFMR1 = IC PULSE XFMR 1CT:1CT 350UH SMD: PULSE XFMR 1CT:1CT 350UH SMD; Manufacturer: Bourns Inc.; Isolation Voltage: 1.5kVrms; Supplier: Digikey; Supplier_PN: PT61018AAPEL-SCT-ND; Inductance: 350uH; Supplier 1: Digi-Key; Supplier Part Number 1: PT61018AAPEL-SCT-ND